# Altium project Inverter_LCEE.PrjPcb (part 1 of 2)
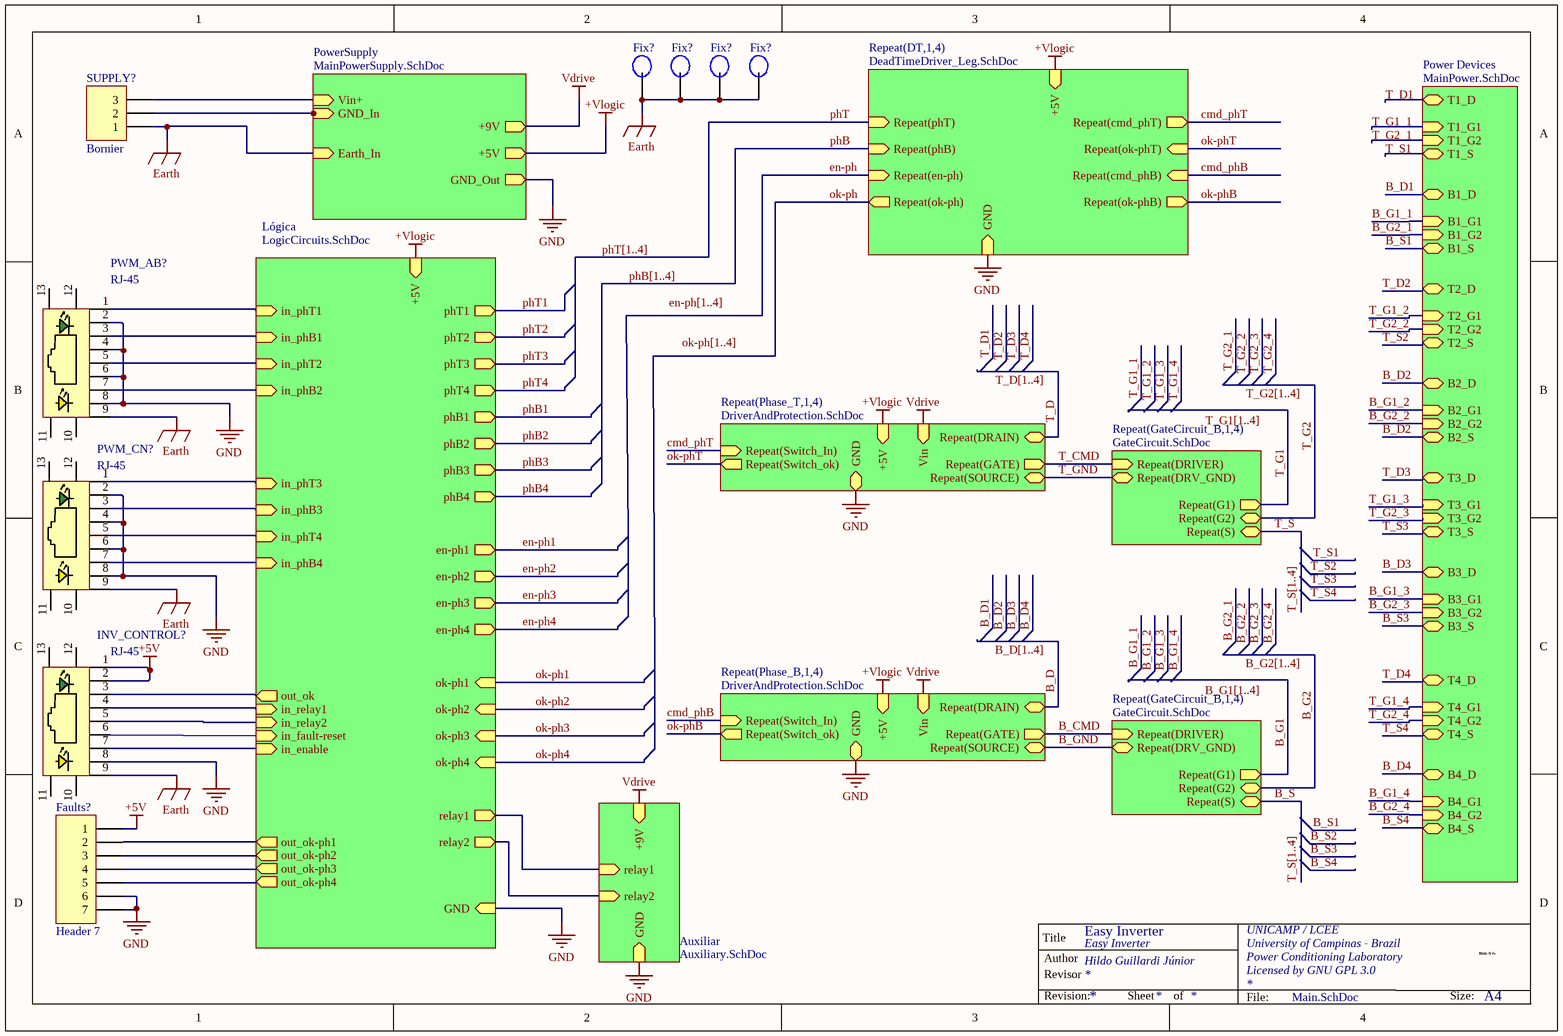
[diagram p0: Main.SchDoc]
9 sheets, 1036 parts. Net scope: hierarchical (ports join the sheet entries above them; power ports are global).
Board file: Inverter_full.PcbDoc
Sheets:
  Main.SchDoc
    Power Devices = MainPower.SchDoc
    Phase_T1 = DriverAndProtection.SchDoc
      Supply_Iso = GateDriverPowerSupply.SchDoc
    Phase_T2 = DriverAndProtection.SchDoc
      Supply_Iso = GateDriverPowerSupply.SchDoc
    Phase_T3 = DriverAndProtection.SchDoc
      Supply_Iso = GateDriverPowerSupply.SchDoc
    Phase_T4 = DriverAndProtection.SchDoc
      Supply_Iso = GateDriverPowerSupply.SchDoc
    Lógica = LogicCircuits.SchDoc
    Auxiliar = Auxiliary.SchDoc
    DT1 = DeadTimeDriver_Leg.SchDoc
    DT2 = DeadTimeDriver_Leg.SchDoc
    DT3 = DeadTimeDriver_Leg.SchDoc
    DT4 = DeadTimeDriver_Leg.SchDoc
    PowerSupply = MainPowerSupply.SchDoc
    GateCircuit_B1 = GateCircuit.SchDoc
    GateCircuit_B2 = GateCircuit.SchDoc
    GateCircuit_B3 = GateCircuit.SchDoc
    GateCircuit_B4 = GateCircuit.SchDoc
    Phase_B1 = DriverAndProtection.SchDoc
      Supply_Iso = GateDriverPowerSupply.SchDoc
    Phase_B2 = DriverAndProtection.SchDoc
      Supply_Iso = GateDriverPowerSupply.SchDoc
    Phase_B3 = DriverAndProtection.SchDoc
      Supply_Iso = GateDriverPowerSupply.SchDoc
    Phase_B4 = DriverAndProtection.SchDoc
      Supply_Iso = GateDriverPowerSupply.SchDoc
    GateCircuit_B1 = GateCircuit.SchDoc
    GateCircuit_B2 = GateCircuit.SchDoc
    GateCircuit_B3 = GateCircuit.SchDoc
    GateCircuit_B4 = GateCircuit.SchDoc

## Sheet Main.SchDoc: Easy Inverter
size A4; Author: Hildo Guillardi Júnior; Organization: UNICAMP / LCEE; Address1: University of Campinas - Brazil; Address2: Power Conditioning Laboratory; Address3: Licensed by GNU GPL 3.0; PageSetup: Record=PageOptions|CenterHorizontal=True|CenterVertical=True|PrintScale=0.98|XCorrection=1.00|YCorrection=1.00|PrintKind=1|BorderSize=5000000|LeftOffset=0|BottomOffset=0|Orientation=2|PaperLength=1000|PaperWidth=1000|Scale=100|PaperSource=257|PrintQuality=600|MediaType=1|DitherType=10|PrintScaleMode=1|PaperKind=A4|PaperIndex=9; ProjectName: Easy Inverter

### Parts
(Parts that share a designator on the sheet are numbered #1, #2 ... from top to bottom, then left to right.)
Faults?  value Header 7  [HDR1X7]
Fix?#1  (no value)  [Pino]
Fix?#2  (no value)  [Pino]
Fix?#3  (no value)  [Pino]
Fix?#4  (no value)  [Pino]
INV_CONTROL?  value RJ-45  [RJ-45]
PWM_AB?  value RJ-45  [RJ-45]
PWM_CN?  value RJ-45  [RJ-45]
SUPPLY?  value Bornier  [3 Pin  Borner]

### Sub-sheets
Auxiliar = Auxiliary.SchDoc: relay1 (in), relay2 (in), GND (in), +9V (in)
Lógica = LogicCircuits.SchDoc: +5V (in), GND (in), out_ok-ph1 (out), out_ok-ph2 (out), ok-ph1 (in), out_ok-ph3 (out), out_ok-ph4 (out), en-ph1 (out), en-ph2 (out), en-ph3 (out), en-ph4 (out), in_enable (in), in_fault-reset (in), in_relay1 (in), relay1 (out), relay2 (out), out_ok (out), ok-ph2 (in), ok-ph3 (in), ok-ph4 (in), phB1 (out), phB2 (out), phT1 (out), phT2 (out), phT3 (out), phB3 (out), phT4 (out), phB4 (out), in_phT1 (in), in_phB1 (in), in_phT2 (in), in_phB2 (in), in_phT4 (in), in_phB4 (in), in_phT3 (in), in_phB3 (in), in_relay2 (in)
Power Devices = MainPower.SchDoc: T1_D (bidir), T1_S (bidir), T1_G1 (in), T1_G2 (in), B1_D (bidir), B1_S (bidir), B1_G1 (in), B1_G2 (in), T2_D (bidir), T2_S (bidir), T2_G1 (in), T2_G2 (in), B2_D (bidir), B2_S (bidir), B2_G1 (in), B2_G2 (in), T3_D (bidir), T3_S (bidir), T3_G1 (in), T3_G2 (in), B3_D (bidir), B3_S (bidir), B3_G1 (in), B3_G2 (in), T4_D (bidir), T4_S (bidir), T4_G1 (in), T4_G2 (in), B4_D (bidir), B4_S (bidir), B4_G1 (in), B4_G2 (in)
PowerSupply = MainPowerSupply.SchDoc: Earth_In (in), +9V (out), +5V (out), GND_Out (out), GND_In (in), Vin+ (in)
Repeat(DT,1,4) = DeadTimeDriver_Leg.SchDoc: Repeat(ok-ph) (out), Repeat(cmd_phT) (out), Repeat(phB) (in), Repeat(ok-phT) (in), Repeat(phT) (in), GND (in), +5V (in), Repeat(ok-phB) (out), Repeat(en-ph) (in), Repeat(cmd_phB) (in)
Repeat(GateCircuit_B,1,4) = GateCircuit.SchDoc: Repeat(G2), Repeat(S), Repeat(G1) (out), Repeat(DRIVER) (in), Repeat(DRV_GND) (bidir)
Repeat(GateCircuit_B,1,4) = GateCircuit.SchDoc: Repeat(G2), Repeat(S), Repeat(G1) (out), Repeat(DRIVER) (in), Repeat(DRV_GND) (bidir)
Repeat(Phase_B,1,4) = DriverAndProtection.SchDoc: Repeat(SOURCE), Repeat(DRAIN), Repeat(GATE) (out), Repeat(Switch_In) (in), Repeat(Switch_ok) (out), +5V (in), Vin (in), GND
Repeat(Phase_T,1,4) = DriverAndProtection.SchDoc: Repeat(SOURCE), Repeat(DRAIN), Repeat(GATE) (out), Repeat(Switch_In) (in), Repeat(Switch_ok) (out), +5V (in), Vin (in), GND

### Nets
+5V: Faults?.1 INV_CONTROL?.1 INV_CONTROL?.2 ; sheet Repeat(Phase_T,1,4)/+5V, sheet Lógica/+5V, sheet Repeat(DT,1,4)/+5V, sheet PowerSupply/+5V, sheet Repeat(Phase_B,1,4)/+5V  [also labelled +Vlogic]
Earth: Fix?#1.0 Fix?#2.0 Fix?#3.0 Fix?#4.0 INV_CONTROL?.9 PWM_AB?.9 PWM_CN?.9 SUPPLY?.1 ; sheet PowerSupply/Earth_In
GND: Faults?.6 Faults?.7 INV_CONTROL?.8 PWM_AB?.2 PWM_AB?.4 PWM_AB?.6 PWM_AB?.8 PWM_CN?.2 PWM_CN?.4 PWM_CN?.6 PWM_CN?.8 SUPPLY?.2 ; sheet Repeat(Phase_T,1,4)/GND, sheet Lógica/GND, sheet Auxiliar/GND, sheet Repeat(DT,1,4)/GND, sheet PowerSupply/GND_Out, sheet PowerSupply/GND_In, sheet Repeat(Phase_B,1,4)/GND  [project net 0]
Vdrive: sheet Repeat(Phase_T,1,4)/Vin, sheet Auxiliar/+9V, sheet PowerSupply/+9V, sheet Repeat(Phase_B,1,4)/Vin  [project net +9V]
B_CMD: sheet Repeat(Phase_B,1,4)/Repeat(GATE), sheet Repeat(GateCircuit_B,1,4)/Repeat(DRIVER)
B_D: sheet Repeat(Phase_B,1,4)/Repeat(DRAIN)
B_D1: sheet Power Devices/T1_S, sheet Power Devices/B1_D  [also labelled T_S1]
B_D2: sheet Power Devices/B1_S, sheet Power Devices/T2_S, sheet Power Devices/B2_D, sheet Power Devices/B2_S  [also labelled B_S1, T_S2]
B_D3: sheet Power Devices/T3_S, sheet Power Devices/B3_D  [also labelled T_S3]
B_G1: sheet Repeat(GateCircuit_B,1,4)/Repeat(G1)
B_G2: sheet Repeat(GateCircuit_B,1,4)/Repeat(G2)
B_GND: sheet Repeat(Phase_B,1,4)/Repeat(SOURCE), sheet Repeat(GateCircuit_B,1,4)/Repeat(DRV_GND)
B_S: sheet Repeat(GateCircuit_B,1,4)/Repeat(S)
cmd_phB: sheet Repeat(DT,1,4)/Repeat(cmd_phB), sheet Repeat(Phase_B,1,4)/Repeat(Switch_In)
cmd_phT: sheet Repeat(Phase_T,1,4)/Repeat(Switch_In), sheet Repeat(DT,1,4)/Repeat(cmd_phT)
en-ph: sheet Repeat(DT,1,4)/Repeat(en-ph)
en-ph1: sheet Lógica/en-ph1, sheet Lógica/en-ph2  [also labelled en-ph2]
en-ph3: sheet Lógica/en-ph3, sheet Lógica/en-ph4  [also labelled en-ph4]
ok-ph: sheet Repeat(DT,1,4)/Repeat(ok-ph)
ok-phB: sheet Repeat(DT,1,4)/Repeat(ok-phB), sheet Repeat(Phase_B,1,4)/Repeat(Switch_ok)
ok-phT: sheet Repeat(Phase_T,1,4)/Repeat(Switch_ok), sheet Repeat(DT,1,4)/Repeat(ok-phT)
phB: sheet Repeat(DT,1,4)/Repeat(phB)
phT: sheet Repeat(DT,1,4)/Repeat(phT)
T_CMD: sheet Repeat(Phase_T,1,4)/Repeat(GATE), sheet Repeat(GateCircuit_B,1,4)/Repeat(DRIVER)
T_D: sheet Repeat(Phase_T,1,4)/Repeat(DRAIN)
T_D1: sheet Power Devices/T1_D, sheet Power Devices/T2_D  [also labelled T_D2]
T_G1: sheet Repeat(GateCircuit_B,1,4)/Repeat(G1)
T_G2: sheet Repeat(GateCircuit_B,1,4)/Repeat(G2)
T_GND: sheet Repeat(Phase_T,1,4)/Repeat(SOURCE), sheet Repeat(GateCircuit_B,1,4)/Repeat(DRV_GND)
T_S: sheet Repeat(GateCircuit_B,1,4)/Repeat(S)
NetCin3_1: SUPPLY?.3 ; sheet PowerSupply/Vin+
NetFaults?_2: Faults?.2 ; sheet Lógica/out_ok-ph1
NetFaults?_3: Faults?.3 ; sheet Lógica/out_ok-ph2
NetFaults?_4: Faults?.4 ; sheet Lógica/out_ok-ph3
NetFaults?_5: Faults?.5 ; sheet Lógica/out_ok-ph4
NetINV_CONTROL?_3: INV_CONTROL?.3 ; sheet Lógica/out_ok
NetINV_CONTROL?_4: INV_CONTROL?.4 ; sheet Lógica/in_relay1
NetINV_CONTROL?_5: INV_CONTROL?.5 ; sheet Lógica/in_relay2
NetINV_CONTROL?_6: INV_CONTROL?.6 ; sheet Lógica/in_fault-reset
NetINV_CONTROL?_7: INV_CONTROL?.7 ; sheet Lógica/in_enable
NetPWM_AB?_1: PWM_AB?.1 ; sheet Lógica/in_phT1
NetPWM_AB?_3: PWM_AB?.3 ; sheet Lógica/in_phB1
NetPWM_AB?_5: PWM_AB?.5 ; sheet Lógica/in_phT2
NetPWM_AB?_7: PWM_AB?.7 ; sheet Lógica/in_phB2
NetPWM_CN?_1: PWM_CN?.1 ; sheet Lógica/in_phT3
NetPWM_CN?_3: PWM_CN?.3 ; sheet Lógica/in_phB3
NetPWM_CN?_5: PWM_CN?.5 ; sheet Lógica/in_phT4
NetPWM_CN?_7: PWM_CN?.7 ; sheet Lógica/in_phB4
NetR2_1: sheet Lógica/relay1, sheet Auxiliar/relay1
NetR4_1: sheet Lógica/relay2, sheet Auxiliar/relay2

Not connected (* = marked no-connect by the designer): INV_CONTROL? 10 11 12 13; PWM_AB? 10 11 12 13; PWM_CN? 10 11 12 13

### Buses and harness runs
bus B_D[1..4]
bus B_G1[1..4]
bus B_G2[1..4]
bus en-ph[1..4]
bus ok-ph[1..4]
bus phB[1..4]
bus phT[1..4]
bus T_D[1..4]
bus T_G1[1..4]
bus T_G2[1..4]
bus T_S[1..4]

### Notes on the sheet
- Labels drawn without touching a wire or pin: B_G1[1..4], en-ph[1..4], ok-ph[1..4], T_G1[1..4], T_S[1..4]
- Title
- Author
- Revisor
- Hildo G Jr
- Revision:
- Sheet
- of
- File:
- Size:
- A4
- HGJr

### Library data of the parts
Faults? = Header 7: Header, 7-Pin
Fix?#1-Fix?#4 = Pino: Value: Pin; pn: 908-100; RM2X12MM 2701
INV_CONTROL? PWM_AB? PWM_CN? = RJ-45: pn: A-2004-2-4-LPS-N-R
SUPPLY? = Header 3: Header, 3-Pin; pn: 1935174

## Sheet MainPower.SchDoc: Main / high power
size A4; Author: Hildo Guillardi Júnior; Organization: UNICAMP / LCEE; Address1: University of Campinas - Brazil; Address2: Power Conditioning Laboratory; Address3: Licensed by GNU GPL 3.0; ProjectName: Easy Inverter
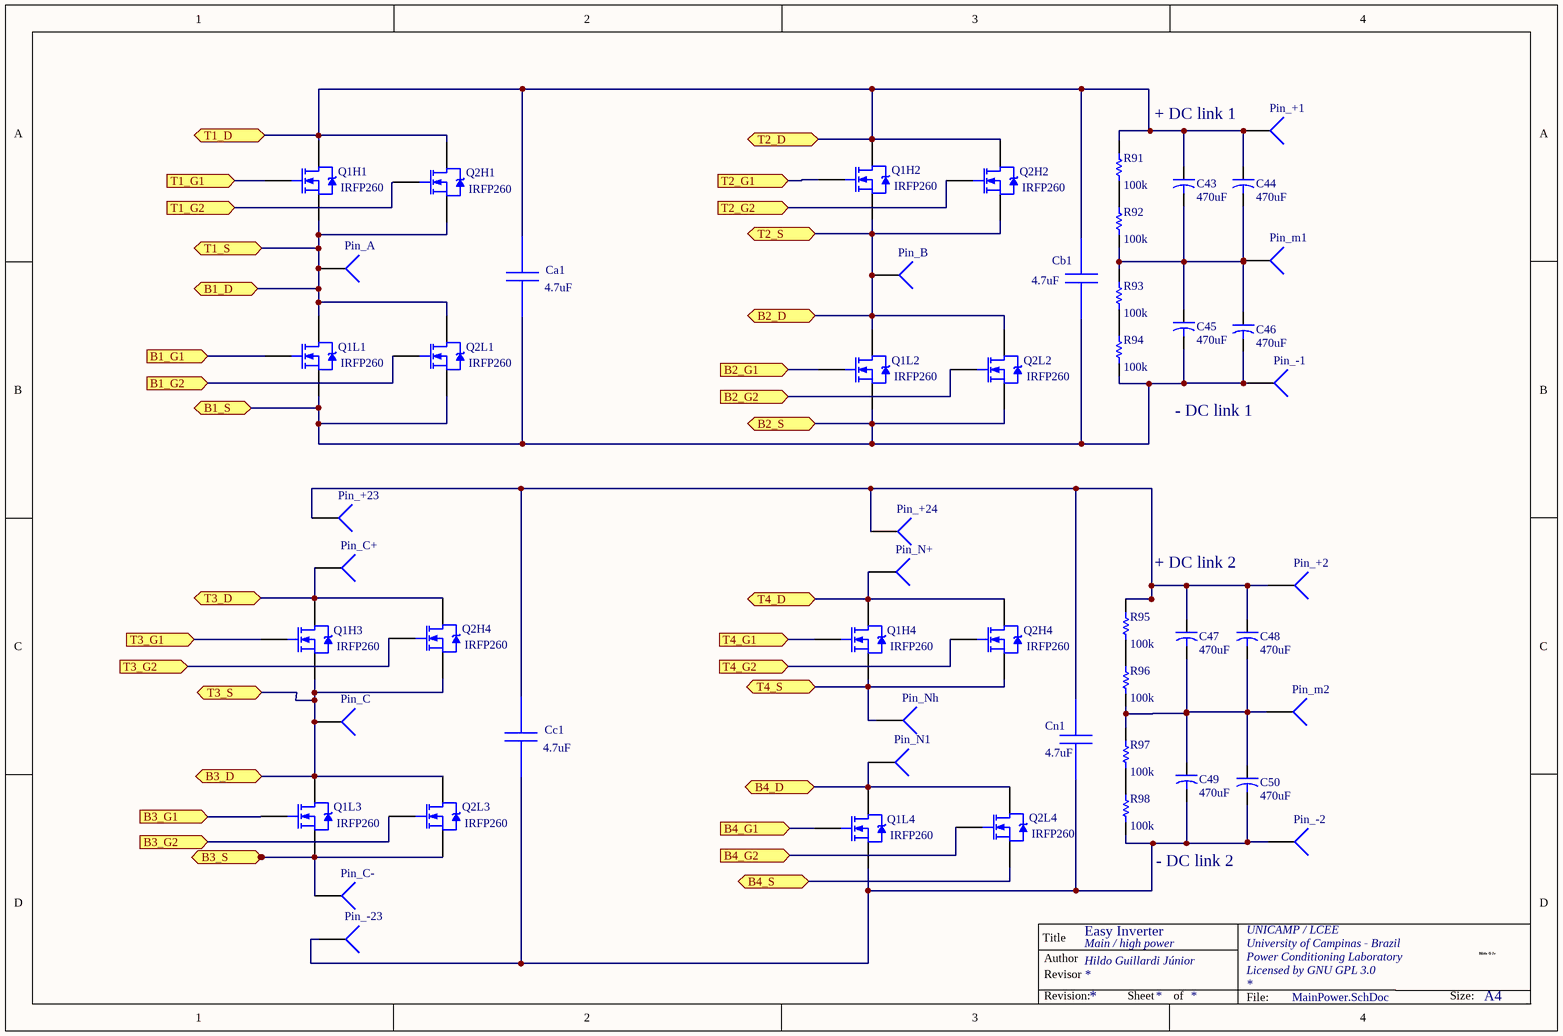
[diagram p1: MainPower.SchDoc]

### Parts
(Parts that share a designator on the sheet are numbered #1, #2 ... from top to bottom, then left to right.)
C43  value 470uF  [Capacitor Eletrolitico - duplicate]
C44  value 470uF  [Capacitor Eletrolitico - duplicate]
C45  value 470uF  [Capacitor Eletrolitico - duplicate]
C46  value 470uF  [Capacitor Eletrolitico - duplicate]
C47  value 470uF  [Capacitor Eletrolitico - duplicate]
C48  value 470uF  [Capacitor Eletrolitico - duplicate]
C49  value 470uF  [Capacitor Eletrolitico - duplicate]
C50  value 470uF  [Capacitor Eletrolitico - duplicate]
Ca1  value 4.7uF  [CApacitor SMD - 22uF]
Cb1  value 4.7uF  [CApacitor SMD - 22uF]
Cc1  value 4.7uF  [CApacitor SMD - 22uF]
Cn1  value 4.7uF  [CApacitor SMD - 22uF]
Pin_+1  (no value)  [Power conector]
Pin_+2  (no value)  [Power conector]
Pin_+23  (no value)  [Power conector]
Pin_+24  (no value)  [Power conector]
Pin_-1  (no value)  [Power conector]
Pin_-2  (no value)  [Power conector]
Pin_-23  (no value)  [Power conector]
Pin_A  (no value)  [Power conector]
Pin_B  (no value)  [Power conector]
Pin_C  (no value)
Pin_C+  (no value)  [Power conector]
Pin_C-  (no value)  [Power conector]
Pin_m1  (no value)  [Power conector]
Pin_m2  (no value)  [Power conector]
Pin_N1  (no value)  [Power conector]
Pin_N+  (no value)  [Power conector]
Pin_Nh  (no value)  [Power conector]
Q1H1  IRFP260  [TO227]
Q1H2  IRFP260  [TO227]
Q1H3  IRFP260  [TO227]
Q1H4  IRFP260  [TO227]
Q1L1  IRFP260  [TO227]
Q1L2  IRFP260  [TO227]
Q1L3  IRFP260  [TO227]
Q1L4  IRFP260  [TO227]
Q2H1  IRFP260  [TO227]
Q2H2  IRFP260  [TO227]
Q2H4#1  IRFP260  [TO227]
Q2H4#2  IRFP260  [TO227]
Q2L1  IRFP260  [TO227]
Q2L2  IRFP260  [TO227]
Q2L3  IRFP260  [TO227]
Q2L4  IRFP260  [TO227]
R91  value 100k  [1210_W]
R92  value 100k  [1210_W]
R93  value 100k  [1210_W]
R94  value 100k  [1210_W]
R95  value 100k  [1210_W]
R96  value 100k  [1210_W]
R97  value 100k  [1210_W]
R98  value 100k  [1210_W]

### Ports
B1_D (bidir), B1_G1 (in), B1_G2 (in), B1_S (bidir), B2_D (bidir), B2_G1 (in), B2_G2 (in), B2_S (bidir), B3_D (bidir), B3_G1 (in), B3_G2 (in), B3_S (bidir), B4_D (bidir), B4_G1 (in), B4_G2 (in), B4_S (bidir), T1_D (bidir), T1_G1 (in), T1_G2 (in), T1_S (bidir), T2_D (bidir), T2_G1 (in), T2_G2 (in), T2_S (bidir), T3_D (bidir), T3_G1 (in), T3_G2 (in), T3_S (bidir), T4_D (bidir), T4_G1 (in), T4_G2 (in), T4_S (bidir)

### Nets
B_D1: Pin_A.1 Q1H1.3(S) Q1L1.2(D) Q2H1.3(S) Q2L1.2(D) ; port B1_D, port T1_S
B_D2: C45.2 C46.2 Ca1.2 Cb1.2 Pin_-1.1 Pin_B.1 Q1H2.3(S) Q1L1.3(S) Q1L2.2(D) Q1L2.3(S) Q2H2.3(S) Q2L1.3(S) Q2L2.2(D) Q2L2.3(S) R94.2 ; port B1_S, port T2_S, port B2_D, port B2_S
B_D3: Pin_C.1 Q1H3.3(S) Q1L3.2(D) Q2H4#1.3(S) Q2L3.2(D) ; port T3_S, port B3_D
B_D4: Pin_N1.1 Q2L4.2(D) ; port B4_D
B_G1_1: Q1L1.1(G) ; port B1_G1
B_G1_2: Q1L2.1(G) ; port B2_G1
B_G1_3: Q1L3.1(G) ; port B3_G1
B_G1_4: Q1L4.1(G) ; port B4_G1
B_G2_1: Q2L1.1(G) ; port B1_G2
B_G2_2: Q2L2.1(G) ; port B2_G2
B_G2_3: Q2L3.1(G) ; port B3_G2
B_G2_4: Q2L4.1(G) ; port B4_G2
B_S3: Pin_C-.1 Q1L3.3(S) Q2L3.3(S) ; port B3_S
B_S4: Q2L4.3(S) ; port B4_S
T_D1: C43.1 C44.1 Ca1.1 Cb1.1 Pin_+1.1 Q1H1.2(D) Q1H2.2(D) Q2H1.2(D) Q2H2.2(D) R91.1 ; port T1_D, port T2_D
T_D3: Pin_C+.1 Q2H4#1.2(D) ; port T3_D
T_D4: Pin_N+.1 Q1H4.2(D) Q2H4#2.2(D) ; port T4_D
T_G1_1: Q1H1.1(G) ; port T1_G1
T_G1_2: Q1H2.1(G) ; port T2_G1
T_G1_3: Q1H3.1(G) ; port T3_G1
T_G1_4: Q1H4.1(G) ; port T4_G1
T_G2_1: Q2H1.1(G) ; port T1_G2
T_G2_2: Q2H2.1(G) ; port T2_G2
T_G2_3: Q2H4#1.1(G) ; port T3_G2
T_G2_4: Q2H4#2.1(G) ; port T4_G2
T_S4: Pin_Nh.1 Q1H4.3(S) Q2H4#2.3(S) ; port T4_S
NetC43_2: C43.2 C44.2 C45.1 C46.1 Pin_m1.1 R92.2 R93.1
NetC47_1: C47.1 C48.1 Cc1.1 Cn1.1 Pin_+2.1 Pin_+23.1 Pin_+24.1 R95.1
NetC47_2: C47.2 C48.2 C49.1 C50.1 Pin_m2.1 R96.2 R97.1
NetC49_2: C49.2 C50.2 Cc1.2 Cn1.2 Pin_-2.1 Pin_-23.1 Q1L4.3(S) R98.2
NetR91_2: R91.2 R92.1
NetR93_2: R93.2 R94.1
NetR95_2: R95.2 R96.1
NetR97_2: R97.2 R98.1

Not connected (* = marked no-connect by the designer): Q1H3 2(D); Q1L4 2(D)

### Notes on the sheet
- (near Pin_+1) + DC link 1
- (near Pin_-1) - DC link 1
- + DC link 2
- - DC link 2
- Title
- Author
- Revisor
- Hildo G Jr
- Revision:
- Sheet
- of
- File:
- Size:
- A4
- HGJr

### Library data of the parts
C43-C50 = Cap2: Capacitor; PackageReference: CAPR5-4X5; Published: 23-Sep-2002; Publisher: Altium Limited; PackageDescription: Capacitor; 2 Leads
Ca1 Cb1 Cc1 Cn1 = GRM21BC81E475KA12L: Manufacturer Name: MuRata; PackageReference: GRM21BC81E475KA12L; Manufacturer Part Number: GRM21BC81E475KA12L
Pin_+1 Pin_+2 Pin_+23 Pin_+24 Pin_-1 Pin_-2 Pin_-23 Pin_A Pin_B Pin_C Pin_C+ Pin_C- Pin_m1 Pin_m2 Pin_N1 Pin_N+ Pin_Nh = Socket: pn: 7799; Value: screw
Q1H1-Q1H4 Q1L1-Q1L4 Q2H1 Q2H2 Q2H4#1 Q2H4#2 Q2L1-Q2L4 = IRFP260: HEXFET Power MOSFET; pn: 4180G; RM3X10MM 2701; IRFP260MPBF; 28N65M2; C3M0280090D; Value: IRFP260
R91-R98 = Res_0805: Resistor; Manufacturer: Generic Components; Class: Passive; Published: 08/06/2000; Publisher: Altium Hobart Technology Centre; SubClass: Resistor

## Sheet DriverAndProtection.SchDoc: Drive and protections
size A4; CheckedBy: Hildo Guillardi Júnior; Author: Fellipe; Organization: UNICAMP / LCEE; Address1: University of Campinas - Brazil; Address2: Power Conditioning Laboratory; Address3: Licensed by GNU GPL 3.0; ProjectName: Easy Inverter
Used 8 times, as channels Phase_T1, Phase_T2, Phase_T3, Phase_T4, Phase_B1, Phase_B2, Phase_B3, Phase_B4. Parts and nets are listed once, with the designators drawn on the sheet.
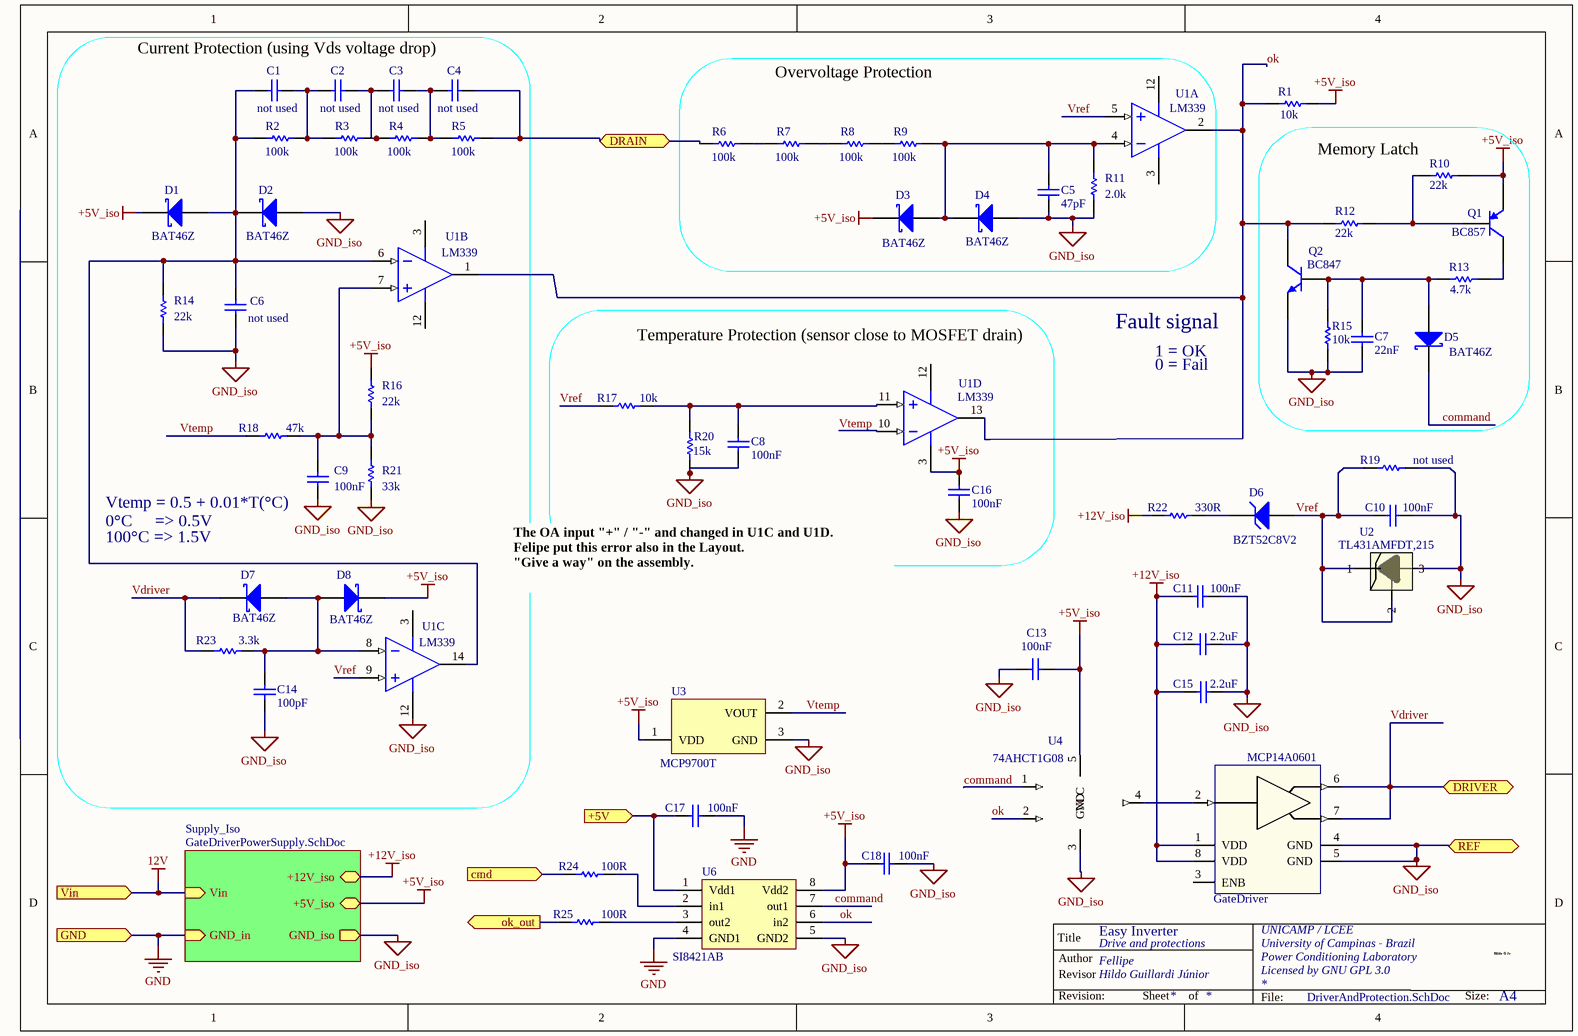
[diagram p2: DriverAndProtection.SchDoc]

### Parts
C1  value not used  [0805_W]
C2  value not used  [0805_W]
C3  value not used  [0805_W]
C4  value not used  [0805_W]
C5  value 47pF  [0805_W]
C6  value not used  [0805_W]
C7  value 22nF  [0805_W]
C8  value 100nF  [0805_W]
C9  value 100nF  [0805_W]
C10  value 100nF  [0805_W]
C11  value 100nF  [0805_W]
C12  value 2.2uF  [0805_W]
C13  value 100nF  [0805_W]
C14  value 100pF  [0805_W]
C15  value 2.2uF  [0805_W]
C16  value 100nF  [0805_W]
C17  value 100nF  [0805_W]
C18  value 100nF  [0805_W]
D1  value BAT46Z  [SOD-123]
D2  value BAT46Z  [SOD-123]
D3  value BAT46Z  [SOD-123]
D4  value BAT46Z  [SOD-123]
D5  value BAT46Z  [SOD-123]
D6  value BZT52C8V2  [SOD-123]
D7  value BAT46Z  [SOD-123]
D8  value BAT46Z  [SOD-123]
GateDriver  value MCP14A0601  [SOIC-8N]
Q1  value BC857  [SOT-23-TT3_N]
Q2  value BC847  [SOT-23-TT3_N]
R1  value 10k  [0805_W]
R2  value 100k  [0805_W]
R3  value 100k  [0805_W]
R4  value 100k  [0805_W]
R5  value 100k  [0805_W]
R6  value 100k  [0805_W]
R7  value 100k  [0805_W]
R8  value 100k  [0805_W]
R9  value 100k  [0805_W]
R10  value 22k  [0805_W]
R11  value 2.0k  [0805_W]
R12  value 22k  [0805_W]
R13  value 4.7k  [0805_W]
R14  value 22k  [0805_W]
R15  value 10k  [0805_W]
R16  value 22k  [0805_W]
R17  value 10k  [0805_W]
R18  value 47k  [0805_W]
R19  value not used  [0805_W]
R20  value 15k  [0805_W]
R21  value 33k  [0805_W]
R22  value 330R  [0805_W]
R23  value 3.3k  [0805_W]
R24  value 100R  [0805_W]
R25  value 100R  [0805_W]
U1  value LM339  [SOIC-14N]  (parts A,B,C,D of 4)
U2  value TL431AMFDT,215  [SOT-23-TT3_M]
U3  value MCP9700T  [SOT-23_L]
U4  value 74AHCT1G08  [SOT353]
U6  value SI8421AB  [SOIC-8N]

### Blocks framed on the sheet
Overvoltage Protection: C5 D3 D4 R6-R9 R11 U1
Memory Latch: C7 D5 Q1 Q2 R10 R12 R13 R15
Temperature Protection (sensor close to MOSFET drain): C8 C16 R17 R20 U1

### Sub-sheets
Supply_Iso = GateDriverPowerSupply.SchDoc: +12V_iso (bidir), +5V_iso (bidir), GND_iso (out), GND_in (in), Vin (in)

### Ports
+5V (in), cmd (in), DRAIN, DRIVER, GND (in), ok_out (out), REF, Vin (in)

### Nets
12V: port Vin, sheet Supply_Iso/Vin
+5V_iso: C13.1 C16.1 C18.2 D1.2(K) D3.2(K) D8.2(K) Q1.2(E) R1.2 R10.1 R16.2 U1.3(V+) U3.1(VDD) U4.5(VCC) U6.8(Vdd2) ; sheet Supply_Iso/+5V_iso
+12V_iso: C11.2 C12.1 C15.1 GateDriver.1(VDD) GateDriver.8(VDD) R22.1 ; sheet Supply_Iso/+12V_iso
GND: C17.1 U6.4(GND1) ; port GND, sheet Supply_Iso/GND_in
GND_iso: C5.2 C6.2 C7.2 C8.2 C9.2 C10.2 C11.1 C12.2 C13.2 C14.2 C15.2 C16.2 C18.1 D2.1(A) D4.1(A) GateDriver.4(GND) GateDriver.5(GND) Q2.2(E) R11.1 R14.1 R15.2 R19.2 R20.2 R21.2 U1.12(V-) U2.3 U3.3(GND) U4.3(GND) U6.5(GND2) ; port REF, sheet Supply_Iso/GND_iso
+5V: C17.2 U6.1(Vdd1) ; port +5V
cmd: R24.2 ; port cmd
command: D5.2(K) U4.1(OE*) U6.7(out1)
DRAIN: C4.1 R5.2 R6.2 ; port DRAIN
ok: Q2.3(C) R1.1 R12.2 U1.1(OUT) U1.2(OUT) U1.13(OUT) U4.2(IN) U6.6(in2)
ok_out: R25.2 ; port ok_out
Vdriver: D7.2(K) GateDriver.6 GateDriver.7 R23.2 ; port DRIVER
Vref: C10.1 D6.1(A) R17.2 R19.1 U1.5(IN+) U1.9(IN+) U2.1 U2.2
Vtemp: R18.2 U3.2(VOUT)
NetC1_1: C1.1 C2.2 R2.2 R3.2
NetC1_2: C1.2 C6.1 D1.1(A) D2.2(K) R2.1 R14.2 U1.6(IN-) U1.14(OUT)
NetC2_1: C2.1 C3.2 R3.1 R4.2
NetC3_1: C3.1 C4.2 R4.1 R5.1
NetC5_1: C5.1 D3.1(A) D4.2(K) R9.1 R11.2 U1.4(IN-)
NetC7_1: C7.1 D5.1(A) Q2.1(B) R13.2 R15.1
NetC8_1: C8.1 R17.1 R20.1 U1.11(IN+)
NetC9_1: C9.1 R16.1 R18.1 R21.1 U1.7(IN+)
NetC14_1: C14.1 D7.1(A) D8.1(A) R23.1 U1.8(IN-)
NetD6_2: D6.2(K) R22.2
NetGateDriver_2: GateDriver.2 U4.4(OUT)
NetQ1_1: Q1.1(B) R10.2 R12.1
NetQ1_3: Q1.3(C) R13.1
NetR6_1: R6.1 R7.2
NetR7_1: R7.1 R8.2
NetR8_1: R8.1 R9.2
NetR24_1: R24.1 U6.2(in1)
NetR25_1: R25.1 U6.3(out2)

Not connected (* = marked no-connect by the designer): GateDriver 3(ENB); U1 10(IN-)

### Channels
Phase_T1: designators C1=C8.2 C2=C9.2 C3=C10.2 C4=C11.2 C5=C13.2 C6=C14.2 C7=C15.2 C8=C8_Phase_T1 C9=C17.2 C10=C18.2 C11=C19.2 C12=C20.2 C13=C13_Phase_T1 C14=C22.2 C15=C21.2 C16=C24.2 C17=C25.2 C18=C26.2 D1=D9.2 D2=D10.2 D3=D11.2 D4=D12.2 D5=D13.2 D6=D6_Phase_T1 D7=D15.2 D8=D16.2 GateDriver=GateDriver_Phase_T1 Q1=Q3.2 Q2=Q4.2 R1=R18.2 R2=R19.2 R3=R20.2 R4=R21.2 R5=R22.2 R6=R23.2 R7=R24.2 R8=R25.2 R9=R26.2 R10=R10_Phase_T1 R11=R27.2 R12=R28.2 R13=R29.2 R14=R14_Phase_T1 R15=R15_Phase_T1 R16=R31.2 R17=R32.2 R18=R33.2 R19=R19_Phase_T1 R20=R34.2 R21=R35.2 R22=R22_Phase_T1 R23=R37.2 R24=R40.2 R25=R41.2 U1=U5.2 U2=U2_Phase_T1 U3=U7.2 U4=U4_Phase_T1 U6=U6_Phase_T1; ports +5V=+5V cmd=NetR40.2_2 DRAIN=T_D1 DRIVER=Vdriver_Phase_T1 GND=0 ok_out=NetR41.2_2 REF=GND_iso Vin=+9V
Phase_T2: designators C1=C8.1 C2=C9.1 C3=C10.1 C4=C11.1 C5=C13.1 C6=C14.1 C7=C15.1 C8=C8_Phase_T2 C9=C17.1 C10=C18.1 C11=C19.1 C12=C20.1 C13=C13_Phase_T2 C14=C22.1 C15=C21.1 C16=C24.1 C17=C25.1 C18=C26.1 D1=D9.1 D2=D10.1 D3=D11.1 D4=D12.1 D5=D13.1 D6=D6_Phase_T2 D7=D15.1 D8=D16.1 GateDriver=GateDriver_Phase_T2 Q1=Q3.1 Q2=Q4.1 R1=R18.1 R2=R19.1 R3=R20.1 R4=R21.1 R5=R22.1 R6=R23.1 R7=R24.1 R8=R25.1 R9=R26.1 R10=R10_Phase_T2 R11=R27.1 R12=R28.1 R13=R29.1 R14=R14_Phase_T2 R15=R15_Phase_T2 R16=R31.1 R17=R32.1 R18=R33.1 R19=R19_Phase_T2 R20=R34.1 R21=R35.1 R22=R22_Phase_T2 R23=R37.1 R24=R40.1 R25=R41.1 U1=U5.1 U2=U2_Phase_T2 U3=U7.1 U4=U4_Phase_T2 U6=U6_Phase_T2; ports +5V=+5V cmd=NetR40.1_2 DRAIN=T_D1 DRIVER=Vdriver_Phase_T2 GND=0 ok_out=NetR41.1_2 REF=GND_iso Vin=+9V
Phase_T3: designators end in _Phase_T3; ports +5V=+5V cmd=NetR24_Phase_T3_2 DRAIN=T_D3 DRIVER=Vdriver_Phase_T3 GND=0 ok_out=NetR25_Phase_T3_2 REF=GND_iso Vin=+9V
Phase_T4: designators end in _Phase_T4; ports +5V=+5V cmd=NetR24_Phase_T4_2 DRAIN=T_D4 DRIVER=Vdriver_Phase_T4 GND=0 ok_out=NetR25_Phase_T4_2 REF=GND_iso Vin=+9V
Phase_B1: designators end in _Phase_B1; ports +5V=+5V cmd=NetR24_Phase_B1_2 DRAIN=B_D1 DRIVER=Vdriver_Phase_B1 GND=0 ok_out=NetR25_Phase_B1_2 REF=GND_iso Vin=+9V
Phase_B2: designators end in _Phase_B2; ports +5V=+5V cmd=NetR24_Phase_B2_2 DRAIN=B_D2 DRIVER=Vdriver_Phase_B2 GND=0 ok_out=NetR25_Phase_B2_2 REF=GND_iso Vin=+9V
Phase_B3: designators end in _Phase_B3; ports +5V=+5V cmd=NetR24_Phase_B3_2 DRAIN=B_D3 DRIVER=Vdriver_Phase_B3 GND=0 ok_out=NetR25_Phase_B3_2 REF=GND_iso Vin=+9V
Phase_B4: designators end in _Phase_B4; ports +5V=+5V cmd=NetR24_Phase_B4_2 DRAIN=B_D4 DRIVER=Vdriver_Phase_B4 GND=0 ok_out=NetR25_Phase_B4_2 REF=GND_iso Vin=+9V

### Notes on the sheet
- Current Protection (using Vds voltage drop)
- (near Q2) Fault signal
- 1 = OK
- 0 = Fail
- (near C9) Vtemp = 0.5 + 0.01*T(°C)
- 0°C     => 0.5V
- 100°C => 1.5V
- The OA input "+" / "-" and changed in U1C and U1D.
  Felipe put this error also in the Layout.
  "Give a way" on the assembly.
- Labels drawn without touching a wire or pin: Vtemp
- Title
- Author
- Revisor
- Hildo G Jr
- Revision:
- Sheet
- of
- File:
- Size:
- A4
- HGJr

### Library data of the parts
C1-C4 C6 = Cap_0805: Capacitor
  C1-C4: Published: 8-Jun-2000; LatestRevisionDate: 17-Jul-2002; LatestRevisionNote: Re-released for DXP Platform.; PackageReference: RAD-0.3; Publisher: Altium Limited
C5 = Cap_0805: Capacitor; pn: C0805C473K8RAC7800
C7 = Cap_0805: Capacitor; pn: C0805C223K8RACTU
C8-C11 C17 C18 = Cap_0805: Capacitor; pn: 08053C104KAT2A
C12 C15 = Capacitor_nao_polarizado: Capacitor nao polarizado; pn: 08053C225KAT2A
C13 C16 = Cap_0805: Capacitor; pn: C0805C104K8RACTU
C14 = Cap_0805: Capacitor; pn: 08053C101KAT2A
D1-D4 D7 D8 = D Schottky: Schottky Diode; pn: BAT46ZFILM
D5 = Schottky: Diodo Schottky; pn: BAT46ZFILM
D6 = D Zener: Zener Diode; pn: BZT52C8V2-FDICT-ND
GateDriver = GateDriver: pn: MIC4420YM-TR;MIC4422ZM
Q1 = BC857: PNP General-purpose Transistor; pn: BC857BLT1G
Q2 = BC847: NPN General-purpose Transistor; pn: BC847BLT1G
R1 R17 = Res_0805: Resistor; pn: RMCF0805JT10K0
R2-R9 = Res_0805: Resistor; pn: RMCF0805JT100K
R10 = Res_0805: Resistor- Not Used; pn: RMCF0805JT22K0
R11 = Res_0805: Resistor; pn: RMCF0805JT2K00
R12 R16 = Res_0805: Resistor; pn: RMCF0805JT22K0
R13 = Res_0805: Resistor; pn: RMCF0805JT4K70
R14 = Res_0805: Resistor; pn: RMCF0805JT560K
R15 = Res_0805: Resistor- Not Used; pn: RMCF0805JT10K0
R18 = Res_0805: Resistor; pn: RMCF0805JT5K60
R19 = Res_0805: Resistor- Not Used
R20 = Res_0805: Resistor; pn: RMCF0805JT15K0
R21 = Res_0805: Resistor; pn: RMCF0805JT33K0
R22 = Res_0805: Resistor- Not Used; pn: RMCF0805JT330R
R23 = Res_0805: Resistor; pn: RMCF0805JT3k30
R24 R25 = Res_0805: Resistor; pn: RMCF0805JT100R
U1 = LM339AD: Low-Power Quad Voltage Comparator; pn: LM339DT
U2 = TL431ACLP: pn: TL431AMFDT\,215
U3 = MCP9700T-E/TT: Low-Power Linear Active Thermistor IC, 3-Pin SOT-23, Extended Temperature, Tape and Reel; pn: MCP9700T-E/TT
U4 = AND: pn: 74AHCT1G08SE-7
U6 = Si8421: Two Channel, High Speed Digital Isolators; pn: SI8421AB-D-IS;SI8422BB-D-IS;FOD8012A

## Sheet GateDriverPowerSupply.SchDoc: Isolated power supply
size A4; Date: Power Conditioning Laboratory; CheckedBy: Hildo / Joel; Author: Fellipe / Arthur; Organization: UNICAMP / LCEE; Address1: University of Campinas - Brazil; Address2: Power Conditioning Laboratory; Address3: Licensed by GNU GPL 3.0; CurrentTime: University of Campinas - Brazil; DocumentFullPathAndName: Licensed by GNU GPL 3.0; ProjectName: Easy Inverter
Used 8 times, as channels Phase_T1/Supply_Iso, Phase_T2/Supply_Iso, Phase_T3/Supply_Iso, Phase_T4/Supply_Iso, Phase_B1/Supply_Iso, Phase_B2/Supply_Iso, Phase_B3/Supply_Iso, Phase_B4/Supply_Iso. Parts and nets are listed once, with the designators drawn on the sheet.
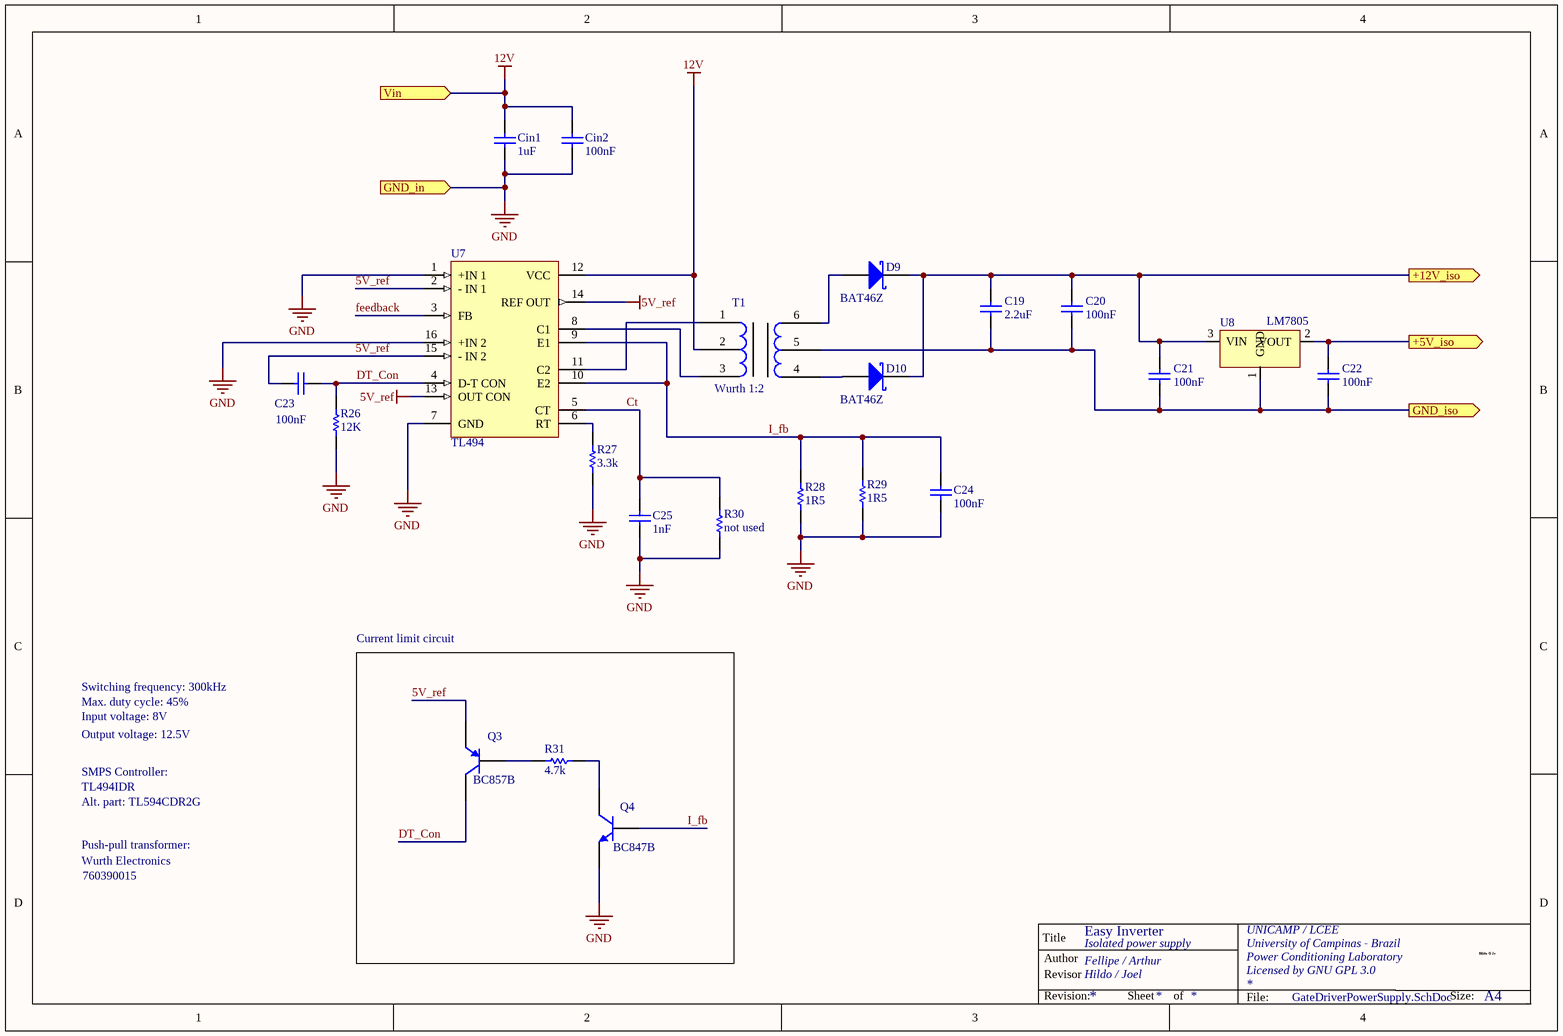
[diagram p3: GateDriverPowerSupply.SchDoc]

### Parts
C19  value 2.2uF  [0805_W]
C20  value 100nF  [0805_W]
C21  value 100nF  [0805_W]
C22  value 100nF  [0805_W]
C23  value 100nF  [0805_W]
C24  value 100nF  [0805_W]
C25  value 1nF  [0805_W]
Cin1  value 1uF  [0805_W]
Cin2  value 100nF  [0805_W]
D9  value BAT46Z  [SOD-123]
D10  value BAT46Z  [SOD-123]
Q3  value BC857B  [SOT-23-TT3_N]
Q4  value BC847B  [SOT-23-TT3_N]
R26  value 12K  [0805_W]
R27  value 3.3k  [0805_W]
R28  value 1R5  [0805_W]
R29  value 1R5  [0805_W]
R30  value not used  [0805_W]
R31  value 4.7k  [0805_W]
T1  value Wurth 1:2  [Trafo]
U7  value TL494  [SOIC16_M]
U8  value LM7805  [LM78XX]

### Blocks framed on the sheet
Current limit circuit: Q3 Q4 R31

### Ports
+5V_iso (out), +12V_iso (out), GND_in (in), GND_iso (out), Vin (in)

### Nets
5V_ref: C23.1 Q3.2(E) U7.2(-_IN_1) U7.13(OUT_CON) U7.14(REF_OUT) U7.15(-_IN_2)
12V: Cin1.1 Cin2.1 T1.2 U7.12(VCC) ; port Vin
GND: C24.1 C25.2 Cin1.2 Cin2.2 Q4.2(E) R26.1 R27.1 R28.1 R29.1 R30.1 U7.1(+IN_1) U7.7(GND) U7.16(+IN_2) ; port GND_in
+5V_iso: C22.1 U8.2(VOUT) ; port +5V_iso
+12V_iso: C19.1 C20.1 C21.1 D9.2(K) D10.2(K) U8.3(VIN) ; port +12V_iso
Ct: C25.1 R30.2 U7.5(CT)
DT_Con: C23.2 Q3.3(C) R26.2 U7.4(D-T_CON)
feedback: U7.3(FB)
GND_iso: C19.2 C20.2 C21.2 C22.2 T1.5 U8.1(GND) ; port GND_iso
I_fb: C24.2 Q4.1(B) R28.2 R29.2 U7.9(E1) U7.10(E2)
NetD9_1: D9.1(A) T1.6
NetD10_1: D10.1(A) T1.4
NetQ3_1: Q3.1(B) R31.2
NetQ4_3: Q4.3(C) R31.1
NetR27_2: R27.2 U7.6(RT)
NetT1_1: T1.1 U7.11(C2)
NetT1_3: T1.3 U7.8(C1)

### Channels
Phase_T1/Supply_Iso: designators C19=C27.1 C20=C29.1 C21=C30.1 C22=C32.1 C23=C31.1 C24=C33.1 C25=C34.1 Cin1=Cin1.1 Cin2=Cin2.1 D9=D9_Phase_T1_Supply_Iso D10=D10_Phase_T1_Supply_Iso Q3=Q5.1 Q4=Q6.1 R26=R42.1 R27=R43.1 R28=R44.1 R29=R45.1 R30=R46.1 R31=R47.1 T1=Transformer1.1 U7=U9.1 U8=Reg1.1; ports +5V_iso=+5V_iso +12V_iso=+12V_iso GND_in=0 GND_iso=GND_iso Vin=+9V
Phase_T2/Supply_Iso: designators C19=C27.2 C20=C29.2 C21=C30.2 C22=C32.2 C23=C31.2 C24=C33.2 C25=C34.2 Cin1=Cin1.2 Cin2=Cin2.2 D9=D9_Phase_T2_Supply_Iso D10=D10_Phase_T2_Supply_Iso Q3=Q5.2 Q4=Q6.2 R26=R42.2 R27=R43.2 R28=R44.2 R29=R45.2 R30=R46.2 R31=R47.2 T1=Transformer1.2 U7=U9.2 U8=Reg1.2; ports +5V_iso=+5V_iso +12V_iso=+12V_iso GND_in=0 GND_iso=GND_iso Vin=+9V
Phase_T3/Supply_Iso: designators end in _Phase_T3_Supply_Iso; ports +5V_iso=+5V_iso +12V_iso=+12V_iso GND_in=0 GND_iso=GND_iso Vin=+9V
Phase_T4/Supply_Iso: designators end in _Phase_T4_Supply_Iso; ports +5V_iso=+5V_iso +12V_iso=+12V_iso GND_in=0 GND_iso=GND_iso Vin=+9V
Phase_B1/Supply_Iso: designators end in _Phase_B1_Supply_Iso; ports +5V_iso=+5V_iso +12V_iso=+12V_iso GND_in=0 GND_iso=GND_iso Vin=+9V
Phase_B2/Supply_Iso: designators end in _Phase_B2_Supply_Iso; ports +5V_iso=+5V_iso +12V_iso=+12V_iso GND_in=0 GND_iso=GND_iso Vin=+9V
Phase_B3/Supply_Iso: designators end in _Phase_B3_Supply_Iso; ports +5V_iso=+5V_iso +12V_iso=+12V_iso GND_in=0 GND_iso=GND_iso Vin=+9V
Phase_B4/Supply_Iso: designators end in _Phase_B4_Supply_Iso; ports +5V_iso=+5V_iso +12V_iso=+12V_iso GND_in=0 GND_iso=GND_iso Vin=+9V

### Notes on the sheet
- Switching frequency: 300kHz
- Max. duty cycle: 45%
- Input voltage: 8V
- SMPS Controller:
- TL494IDR
- Output voltage: 12.5V
- Alt. part: TL594CDR2G
- Push-pull transformer:
- Wurth Electronics
- 760390015
- Title
- Author
- Revisor
- Hildo G Jr
- Revision:
- Sheet
- of
- File:
- Size:
- A4
- HGJr

### Library data of the parts
C19 = Capacitor_nao_polarizado: as C12 on sheet DriverAndProtection
C20-C22 = Capacitor_nao_polarizado: Capacitor nao polarizado; pn: 08053C104KAT2A
C23 C24 Cin2 = Cap_0805: Capacitor; pn: 08053C104KAT2A
C25 = Cap_0805: Capacitor; pn: 08053C102KAT2A
Cin1 = Cap_0805: Capacitor; pn: 08053C105KAT2A
D9 D10 = D Schottky: Schottky Diode; pn: BAT46ZFILM
Q3 = BC857: as Q1 on sheet DriverAndProtection
Q4 = BC847: as Q2 on sheet DriverAndProtection
R26 = Res_0805: Resistor; pn: RMCF0805JT12K0
R27 = Res_0805: Resistor; pn: RMCF0805JT3K30
R28 R29 = Res_0805: Resistor; pn: RMCF0805JT1R50
R30 = Res_0805: as R91 on sheet MainPower; Published: 08/06/2000; Publisher: Altium Hobart Technology Centre; SubClass: Resistor
R31 = Res_0805: Resistor; pn: RMCF0805JT4K70
T1 = Trafo-TI: pn: 760390015
U7 = TL494ID: Pulse-Width-Modulation Control Circuit; pn: TL494IDR
U8 = LM7805: pn: UA78M05CDCY

## Sheet LogicCircuits.SchDoc: Logic circuits
size A4; CheckedBy: Joel Guerreiro; Author: Hildo Guillardi Júnior; Organization: UNICAMP / LCEE; Address1: University of Campinas - Brazil; Address2: Power Conditioning Laboratory; Address3: Licensed by GNU GPL 3.0; Revision: Joel Guerreiro; ProjectName: Easy Inverter
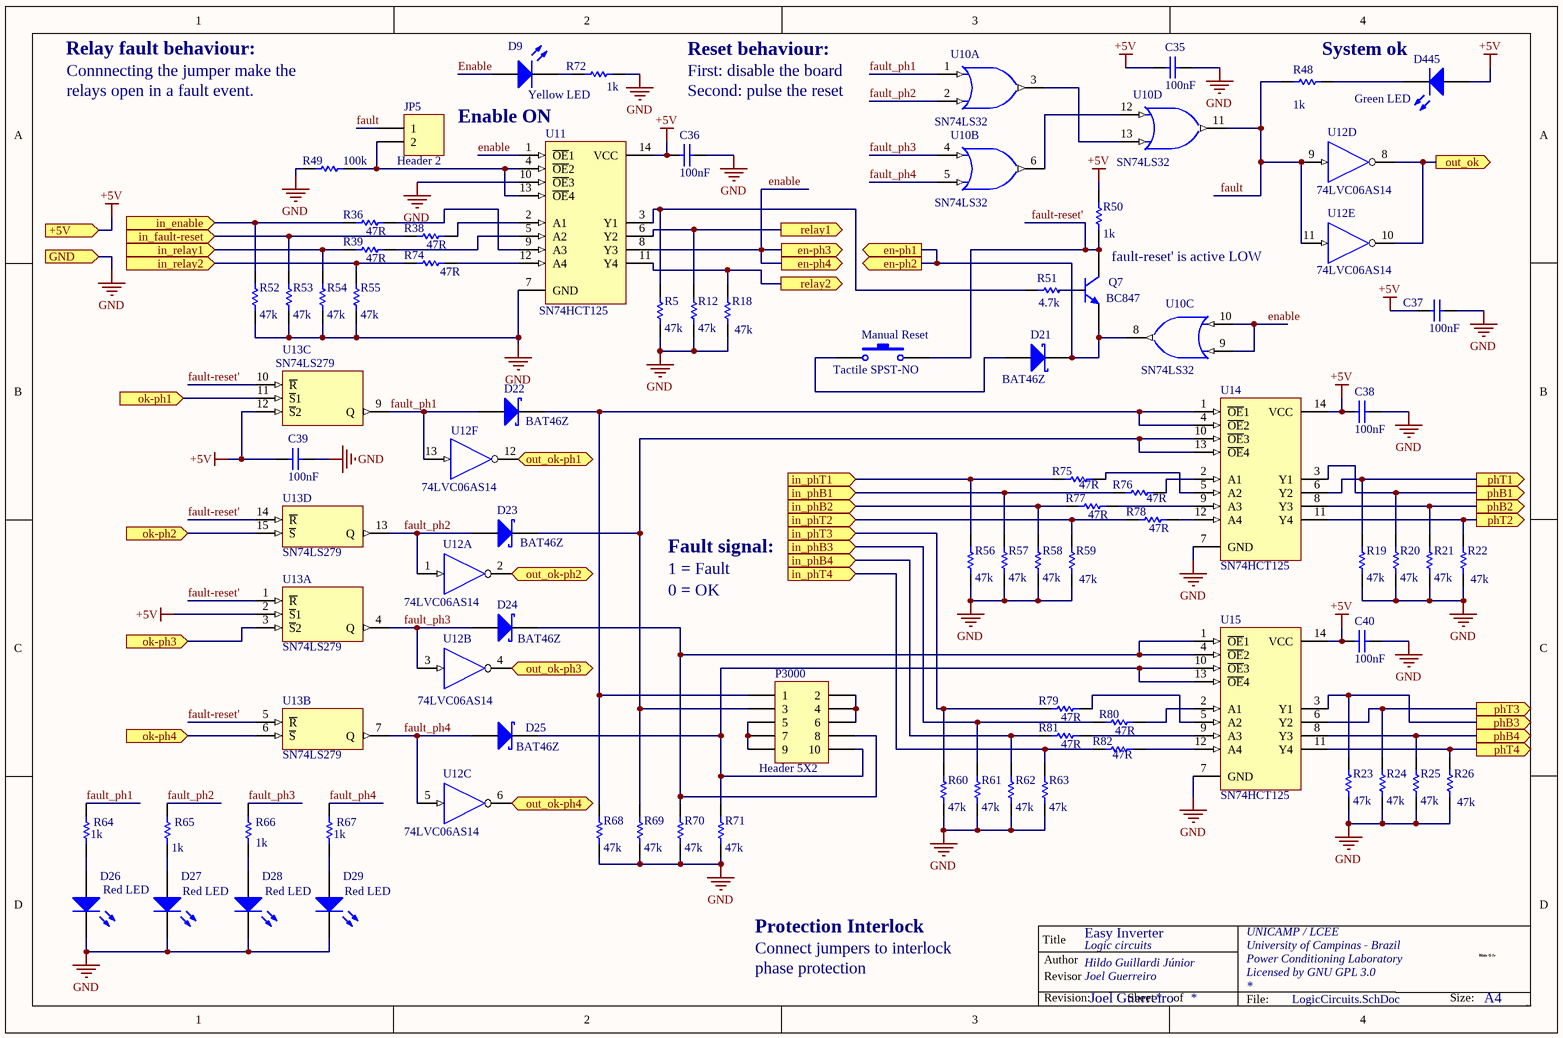
[diagram p4: LogicCircuits.SchDoc]

### Parts
C35  value 100nF  [0805_W]
C36  value 100nF  [0805_W]
C37  value 100nF  [0805_W]
C38  value 100nF  [0805_W]
C39  value 100nF  [0805_W]
C40  value 100nF  [0805_W]
D9  value Yellow LED  [LED_0805]
D21  value BAT46Z  [SOD-123]
D22  value BAT46Z  [SOD-123]
D23  value BAT46Z  [SOD-123]
D24  value BAT46Z  [SOD-123]
D25  value BAT46Z  [SOD-123]
D26  value Red LED  [LED_0805]
D27  value Red LED  [LED_0805]
D28  value Red LED  [LED_0805]
D29  value Red LED  [LED_0805]
D445  value Green LED  [LED_0805]
JP5  value Header 2  [HDR1X2]
Manual_Reset  value Tactile SPST-NO  [Tactile SPST-NO]
P3000  value Header 5X2  [HDR2X5]
Q7  value BC847  [SOT-23-TT3_N]
R5  value 47k  [0805_W]
R12  value 47k  [0805_W]
R18  value 47k  [0805_W]
R19  value 47k  [0805_W]
R20  value 47k  [0805_W]
R21  value 47k  [0805_W]
R22  value 47k  [0805_W]
R23  value 47k  [0805_W]
R24  value 47k  [0805_W]
R25  value 47k  [0805_W]
R26  value 47k  [0805_W]
R36  value 47R  [0805_W]
R38  value 47R  [0805_W]
R39  value 47R  [0805_W]
R48  value 1k  [0805_W]
R49  value 100k  [0805_W]
R50  value 1k  [0805_W]
R51  value 4.7k  [0805_W]
R52  value 47k  [0805_W]
R53  value 47k  [0805_W]
R54  value 47k  [0805_W]
R55  value 47k  [0805_W]
R56  value 47k  [0805_W]
R57  value 47k  [0805_W]
R58  value 47k  [0805_W]
R59  value 47k  [0805_W]
R60  value 47k  [0805_W]
R61  value 47k  [0805_W]
R62  value 47k  [0805_W]
R63  value 47k  [0805_W]
R64  value 1k  [0805_W]
R65  value 1k  [0805_W]
R66  value 1k  [0805_W]
R67  value 1k  [0805_W]
R68  value 47k  [0805_W]
R69  value 47k  [0805_W]
R70  value 47k  [0805_W]
R71  value 47k  [0805_W]
R72  value 1k  [0805_W]
R74  value 47R  [0805_W]
R75  value 47R  [0805_W]
R76  value 47R  [0805_W]
R77  value 47R  [0805_W]
R78  value 47R  [0805_W]
R79  pn: 47R  [0805_W]
R80  value 47R  [0805_W]
R81  value 47R  [0805_W]
R82  value 47R  [0805_W]
U10  value SN74LS32  [SO14-Wide]  (parts A,B,C,D of 4)
U11  value SN74HCT125  [SO14-Wide]
U12  value 74LVC06AS14  [SOIC-14N]  (parts A,B,C,D,E,F of 6)
U13  value SN74LS279  (parts A,B,C,D of 4)
U14  value SN74HCT125  [SO14-Wide]
U15  value SN74HCT125  [SO14-Wide]

### Ports
+5V (in), en-ph1 (out), en-ph2 (out), en-ph3 (out), en-ph4 (out), GND (in), in_enable (in), in_fault-reset (in), in_phB1 (in), in_phB2 (in), in_phB3 (in), in_phB4 (in), in_phT1 (in), in_phT2 (in), in_phT3 (in), in_phT4 (in), in_relay1 (in), in_relay2 (in), ok-ph1 (in), ok-ph2 (in), ok-ph3 (in), ok-ph4 (in), out_ok (out), out_ok-ph1 (out), out_ok-ph2 (out), out_ok-ph3 (out), out_ok-ph4 (out), phB1 (out), phB2 (out), phB3 (out), phB4 (out), phT1 (out), phT2 (out), phT3 (out), phT4 (out), relay1 (out), relay2 (out)

### Nets
+5V: C35.1 C36.1 C37.1 C38.1 C39.1 C40.1 D445.1(A) R50.2 U10.14(VCC) U11.14(VCC) U12.14(VCC) U13.2(~{S}1) U13.12(~{S}2) U13.16(VCC) U14.14(VCC) U15.14(VCC) ; port +5V
GND: C35.2 C36.2 C37.2 C38.2 C39.2 C40.2 D26.2(K) D27.2(K) D28.2(K) D29.2(K) R5.1 R12.1 R18.1 R19.1 R20.1 R21.1 R22.1 R23.1 R24.1 R25.1 R26.1 R49.2 R52.1 R53.1 R54.1 R55.1 R56.1 R57.1 R58.1 R59.1 R60.1 R61.1 R62.1 R63.1 R68.1 R69.1 R70.1 R71.1 R72.2 U10.7(GND) U11.7(GND) U11.10(~{OE}3) U12.7(GND) U13.8(GND) U14.7(GND) U15.7(GND) ; port GND  [project net 0]
en-ph1: D21.2(K) Q7.2(E) U10.8(3Y) ; port en-ph1, port en-ph2
enable: D9.1(A) U10.9(3A) U10.10(3B) U11.1(~{OE}1) U11.8(Y3) ; port en-ph3, port en-ph4  [project net en-ph3]
fault: JP5.1 R48.1 U10.11(4Y) U12.9(4A) U12.11(5A)
fault-reset': Manual_Reset.1 Q7.3(C) R50.1 U13.1(~{R}) U13.5(~{R}) U13.10(~{R}) U13.14(~{R})
fault_ph1: D22.1(A) R64.2 U10.1(1A) U12.13(6A) U13.9(Q)
fault_ph2: D23.1(A) R65.2 U10.2(1B) U12.1(1A) U13.13(Q)
fault_ph3: D24.1(A) R66.2 U10.4(2A) U12.3(2A) U13.4(Q)
fault_ph4: D25.1(A) R67.2 U10.5(2B) U12.5(3A) U13.7(Q)
ok-ph1: U13.11(~{S}1) ; port ok-ph1
ok-ph2: U13.15(~{S}) ; port ok-ph2
ok-ph3: U13.3(~{S}2) ; port ok-ph3
ok-ph4: U13.6(~{S}) ; port ok-ph4
phB: R20.2 U14.3(Y1) ; port phB1
phB: R21.2 U14.8(Y3) ; port phB2  [a separate net that carries the same name]
phB: R23.2 U15.3(Y1) ; port phB3  [a separate net that carries the same name]
phB: R25.2 U15.8(Y3) ; port phB4  [a separate net that carries the same name]
phT: R22.2 U14.11(Y4) ; port phT2
phT: R19.2 U14.6(Y2) ; port phT1  [a separate net that carries the same name]
phT: R26.2 U15.11(Y4) ; port phT4  [a separate net that carries the same name]
phT: R24.2 U15.6(Y2) ; port phT3  [a separate net that carries the same name]
NetD9_2: D9.2(K) R72.1
NetD21_1: D21.1(A) Manual_Reset.2
NetD22_2: D22.2(K) P3000.1 R68.2 U14.1(~{OE}1) U14.4(~{OE}2)
NetD23_2: D23.2(K) P3000.3 R69.2 U14.10(~{OE}3) U14.13(~{OE}4)
NetD24_2: D24.2(K) P3000.8 R70.2 U15.1(~{OE}1) U15.4(~{OE}2)
NetD25_2: D25.2(K) P3000.10 R71.2 U15.10(~{OE}3) U15.13(~{OE}4)
NetD26_1: D26.1(A) R64.1
NetD27_1: D27.1(A) R65.1
NetD28_1: D28.1(A) R66.1
NetD29_1: D29.1(A) R67.1
NetD445_2: D445.2(K) R48.2
NetFaults?_2: U12.12(6~{Y}) ; port out_ok-ph1
NetFaults?_3: U12.2(1~{Y}) ; port out_ok-ph2
NetFaults?_4: U12.4(2~{Y}) ; port out_ok-ph3
NetFaults?_5: U12.6(3~{Y}) ; port out_ok-ph4
NetINV_CONTROL?_3: U12.8(4~{Y}) U12.10(5~{Y}) ; port out_ok
NetINV_CONTROL?_4: R39.2 R54.2 ; port in_relay1
NetINV_CONTROL?_5: R55.2 R74.2 ; port in_relay2
NetINV_CONTROL?_6: R38.2 R53.2 ; port in_fault-reset
NetINV_CONTROL?_7: R36.2 R52.2 ; port in_enable
NetJP5_2: JP5.2 R49.1 U11.4(~{OE}2) U11.13(~{OE}4)
NetP3000_2: P3000.2 P3000.4 P3000.6
NetP3000_5: P3000.5 P3000.7 P3000.9
NetPWM_AB?_1: R56.2 R75.2 ; port in_phT1
NetPWM_AB?_3: R57.2 R76.2 ; port in_phB1
NetPWM_AB?_5: R59.2 R78.2 ; port in_phT2
NetPWM_AB?_7: R58.2 R77.2 ; port in_phB2
NetPWM_CN?_1: R60.2 R79.2 ; port in_phT3
NetPWM_CN?_3: R61.2 R80.2 ; port in_phB3
NetPWM_CN?_5: R63.2 R82.2 ; port in_phT4
NetPWM_CN?_7: R62.2 R81.2 ; port in_phB4
NetQ7_1: Q7.1(B) R51.2
NetR2_1: R12.2 U11.6(Y2) ; port relay1
NetR4_1: R18.2 U11.11(Y4) ; port relay2
NetR5_2: R5.2 R51.1 U11.3(Y1)
NetR36_1: R36.1 U11.9(A3)
NetR38_1: R38.1 U11.2(A1)
NetR39_1: R39.1 U11.5(A2)
NetR74_1: R74.1 U11.12(A4)
NetR75_1: R75.1 U14.5(A2)
NetR76_1: R76.1 U14.2(A1)
NetR77_1: R77.1 U14.9(A3)
NetR78_1: R78.1 U14.12(A4)
NetR79_1: R79.1 U15.5(A2)
NetR80_1: R80.1 U15.2(A1)
NetR81_1: R81.1 U15.9(A3)
NetR82_1: R82.1 U15.12(A4)
NetU10_3: U10.3(1Y) U10.13(4B)
NetU10_6: U10.6(2Y) U10.12(4A)

### Notes on the sheet
- Relay fault behaviour:
- Connnecting the jumper make the
- relays open in a fault event.
- Reset behaviour:
- First: disable the board
- Second: pulse the reset
- System ok
- Enable ON
- fault-reset' is active LOW
- Fault signal:
- 1 = Fault
- 0 = OK
- Protection Interlock
- Connect jumpers to interlock
- phase protection
- Title
- Author
- Revisor
- Hildo G Jr
- Revision:
- Sheet
- of
- File:
- Size:
- A4
- HGJr

### Library data of the parts
C35 C36 = Capacitor_nao_polarizado: Capacitor nao polarizado; Value: Value
C37-C40 = Capacitor_nao_polarizado: Capacitor nao polarizado; pn: C0805C104K8RACTU
D9 = LED0: Typical INFRARED GaAs LED; pn: SML-LXR85YC-TR
D21 D23-D25 = D Schottky: Schottky Diode; np: BAT46ZFILM
D22 = D Schottky: Schottky Diode; pn: BAT46ZFILM
D26-D29 = LED0: Typical INFRARED GaAs LED; pn: SML-LXR85IC-TR
D445 = LED0: Typical INFRARED GaAs LED; pn: SML-LXR85GC-TR
JP5 = Header 2: Header, 2-Pin
Manual_Reset = SW-PB: Switch; pn: FSM4JH
P3000 = Header 5X2: Header, 5-Pin, Dual row
Q7 = BC847: as Q2 on sheet DriverAndProtection
R5 R12 R18-R26 R52-R55 R68-R71 = Res_0805: Resistor; pn: RMCF0805JT47K0
R36 R38 R39 R74-R78 R80-R82 = Res_0805: Resistor; pn: RMCF0805JT47R0
R48 R50 R64-R67 R72 = Res_0805: Resistor; pn: RMCF0805JT1K00
R49 R56-R63 = Res_0805: as R91 on sheet MainPower; Published: 08/06/2000; Publisher: Altium Hobart Technology Centre; SubClass: Resistor; Value: Value
R51 = Res_0805: Resistor; pn: RMCF0805JT4K70
R79 = Res_0805: Resistor; Published: RMCF0805JT47R0
U10 = HD74HC32FP: Quad 2-Input OR Gates; pn: SN74LS32NSR
U11 = M74HC125M1R: Quad Bus Buffer (3-State); pn: SN74HCT125DR
U12 = HD74LV06AFP: Hex Inverter Buffers / Drivers with Open Drain Outputs; Publisher: 74LVC06AS14-13
U13 = SN74LS279AD: Quadruple S-R Latches; pn: SN74LS279ANSR
U14 U15 = M74HC125M1R: Quad Bus Buffer (3-State); Publisher: SN74HCT125DR

## Sheet Auxiliary.SchDoc: Relays & auxiliary circuits
size A4; CheckedBy: Fellipe; Author: Hildo Guillardi Júnior; Organization: UNICAMP / LCEE; Address1: University of Campinas - Brazil; Address2: Power Conditioning Laboratory; Address3: Licensed by GNU GPL 3.0; ProjectName: Easy Inverter
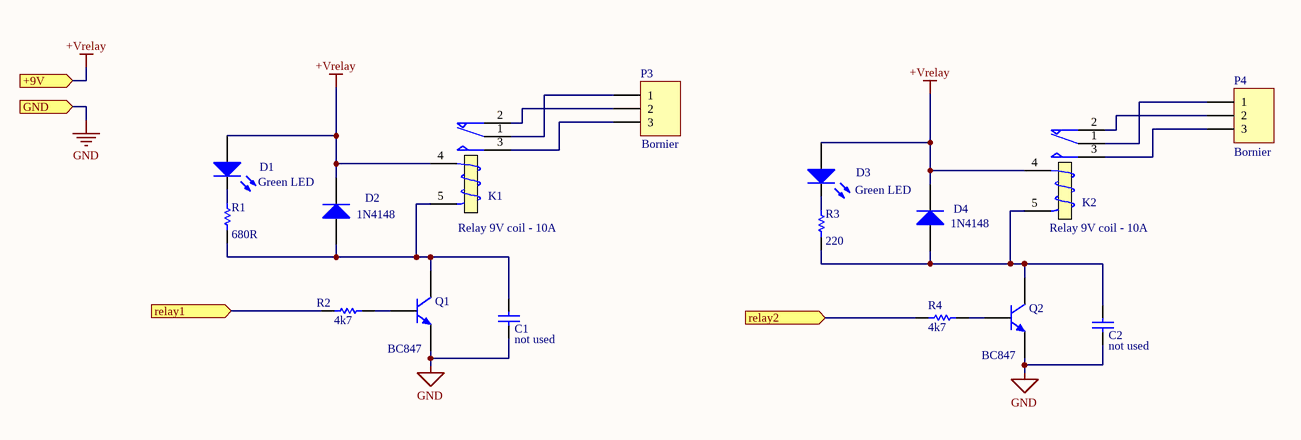
[diagram p5: Auxiliary.SchDoc]

### Parts
C1  value not used  [0805_W]
C2  value not used  [0805_W]
D1  value Green LED  [LED_0805]
D2  value 1N4148  [SOD-123]
D3  value Green LED  [LED_0805]
D4  value 1N4148  [SOD-123]
K1  value Relay 9V coil - 10A  [Relay - SPDT]
K2  value Relay 9V coil - 10A  [Relay - SPDT]
P3  value Bornier  [KK-3_G]
P4  value Bornier  [KK-3_G]
Q1  value BC847  [SOT-23-TT3_L]
Q2  value BC847  [SOT-23-TT3_L]
R1  value 680R  [0805_W]
R2  value 4k7  [0805_W]
R3  value 220  [0805_W]
R4  value 4k7  [0805_W]

### Ports
+9V (in), GND (in), relay1 (in), relay2 (in)

### Nets
+Vrelay: D1.1(A) D2.2(K) D3.1(A) D4.2(K) K1.4(T1) K2.4(T1) ; port +9V  [project net +9V]
GND: C1.1 C2.1 Q1.2(E) Q2.2(E) ; port GND  [project net 0]
NetC1_2: C1.2 D2.1(A) K1.5(T2) Q1.3(C) R1.2
NetC2_2: C2.2 D4.1(A) K2.5(T2) Q2.3(C) R3.2
NetD1_2: D1.2(K) R1.1
NetD3_2: D3.2(K) R3.1
NetK1_1: K1.1(COM) P3.1
NetK1_2: K1.2(NC) P3.2
NetK1_3: K1.3(NO) P3.3
NetK2_1: K2.1(COM) P4.1
NetK2_2: K2.2(NC) P4.2
NetK2_3: K2.3(NO) P4.3
NetQ1_1: Q1.1(B) R2.2
NetQ2_1: Q2.1(B) R4.2
NetR2_1: R2.1 ; port relay1
NetR4_1: R4.1 ; port relay2

### Notes on the sheet
- Title
- Author
- Revisor
- Hildo G Jr
- Revision:
- Sheet
- of
- File:
- Size:
- A4
- HGJr

### Library data of the parts
C1 C2 = Cap: Capacitor
D1 D3 = LED0: as D445 on sheet LogicCircuits
D2 D4 = Diode 1N4148: High Conductance Fast Diode; pn: 1N4148W-TP
K1 K2 = Relay: SPDT Relay; pn: G5LE-14-DC9
P3 P4 = Header 3: Header, 3-Pin; pn: 1935174
Q1 Q2 = BC847: as Q2 on sheet DriverAndProtection
R1 R3 = Res_0805: Resistor; pn: RMCF0805JT680R
R2 R4 = Res1: Resistor; pn: RMCF0805JT4K70

## Sheet DeadTimeDriver_Leg.SchDoc: Dead time & interlock
size A4; CheckedBy: Hildo / Joel; Author: Fellipe; Organization: UNICAMP / LCEE; Address1: University of Campinas - Brazil; Address2: Power Conditioning Laboratory; Address3: Licensed by GNU GPL 3.0; ProjectName: Easy Inverter
Used 4 times, as channels DT1, DT2, DT3, DT4. Parts and nets are listed once, with the designators drawn on the sheet.
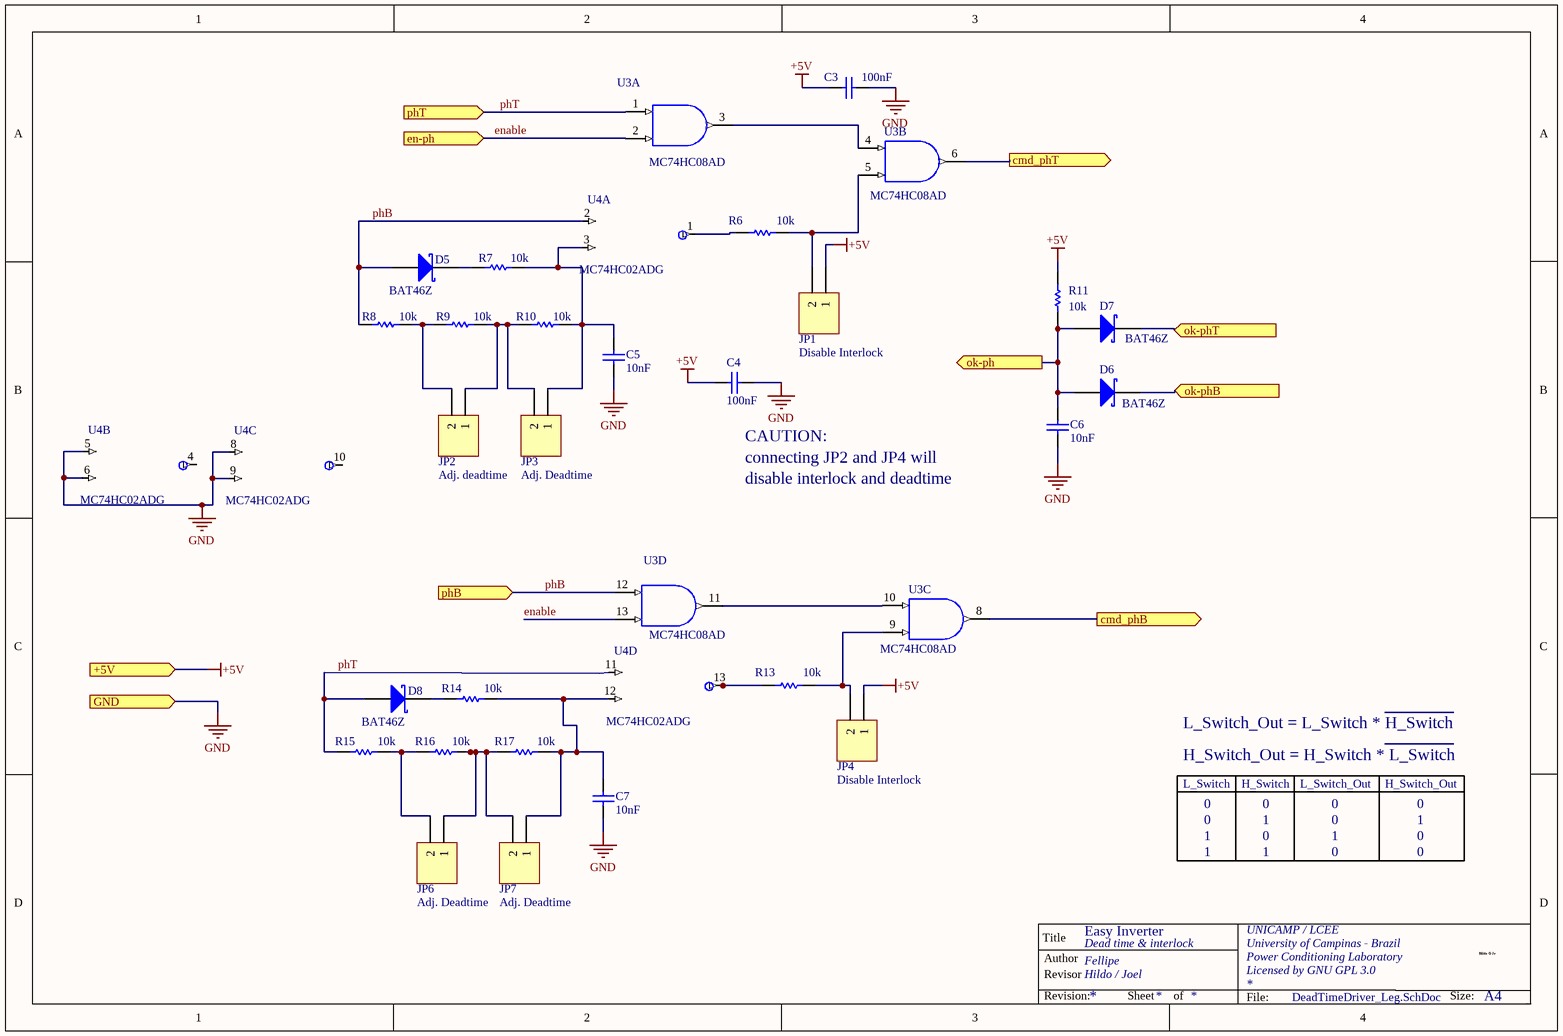
[diagram p6: DeadTimeDriver_Leg.SchDoc]

### Parts
C3  value 100nF  [0805_W]
C4  value 100nF  [0805_W]
C5  value 10nF  [0805_W]
C6  value 10nF  [0805_W]
C7  value 10nF  [0805_W]
D5  value BAT46Z  [SOD-123]
D6  value BAT46Z  [SOD-123]
D7  value BAT46Z  [SOD-123]
D8  value BAT46Z  [SOD-123]
JP1  Disable Interlock  [Jumper]
JP2  Adj. deadtime  [Jumper]
JP3  Adj. Deadtime  [Jumper]
JP4  Disable Interlock  [Jumper]
JP6  Adj. Deadtime  [Jumper]
JP7  Adj. Deadtime  [Jumper]
R6  value 10k  [0805_W]
R7  value 10k  [0805_W]
R8  value 10k  [0805_W]
R9  value 10k  [0805_W]
R10  value 10k  [0805_W]
R11  value 10k  [0805_W]
R13  value 10k  [0805_W]
R14  value 10k  [0805_W]
R15  value 10k  [0805_W]
R16  value 10k  [0805_W]
R17  value 10k  [0805_W]
U3  value MC74HC08AD  [SOIC-14N]  (parts A,B,C,D of 4)
U4  value MC74HC02ADG  [SOIC-14N]  (parts A,B,C,D of 4)

### Ports
+5V (in), cmd_phB (out), cmd_phT (out), en-ph (in), GND (in), ok-ph (out), ok-phB (in), ok-phT (in), phB (in), phT (in)

### Nets
+5V: C3.1 C4.1 JP1.1 JP4.1 R11.2 U3.14(VDD) U4.14(VDD) ; port +5V
GND: C3.2 C4.2 C5.2 C6.2 C7.2 U3.7(GND) U4.5 U4.6 U4.7(GND) U4.8 U4.9 ; port GND
cmd_phB: U3.8(Y) ; port cmd_phB
cmd_phT: U3.6(Y) ; port cmd_phT
enable: U3.2(B) U3.13(B) ; port en-ph
ok-ph: C6.1 D6.1(A) D7.1(A) R11.1 ; port ok-ph
ok-phB: D6.2(K) ; port ok-phB
ok-phT: D7.2(K) ; port ok-phT
phB: D5.1(A) R8.1 U3.12(A) U4.2 ; port phB
phT: D8.1(A) R15.1 U3.1(A) U4.11 ; port phT
NetC5_1: C5.1 JP3.1 R7.2 R10.2 U4.3
NetC7_1: C7.1 JP7.1 R14.2 R17.2 U4.12
NetD5_2: D5.2(K) R7.1
NetD8_2: D8.2(K) R14.1
NetJP1_2: JP1.2 R6.2 U3.5(B)
NetJP2_1: JP2.1 JP3.2 R9.2 R10.1
NetJP2_2: JP2.2 R8.2 R9.1
NetJP4_2: JP4.2 R13.2 U3.9(A)
NetJP6_1: JP6.1 JP7.2 R16.2 R17.1
NetJP6_2: JP6.2 R15.2 R16.1
NetR6_1: R6.1 U4.1
NetR13_1: R13.1 U4.13
NetU3_3: U3.3(Y) U3.4(A)
NetU3_10: U3.10(B) U3.11(Y)

Not connected (* = marked no-connect by the designer): U4 4 10

### Channels
DT1: designators end in _DT1; ports +5V=+5V cmd_phB=cmd_phB1 cmd_phT=cmd_phT1 en-ph=en-ph1 GND=0 ok-ph=ok-ph1 ok-phB=ok-phB1 ok-phT=ok-phT1 phB=phB phT=phT
DT2: designators end in _DT2; ports +5V=+5V cmd_phB=cmd_phB2 cmd_phT=cmd_phT2 en-ph=en-ph1 GND=0 ok-ph=ok-ph2 ok-phB=ok-phB2 ok-phT=ok-phT2 phB=phB phT=phT
DT3: designators end in _DT3; ports +5V=+5V cmd_phB=cmd_phB3 cmd_phT=cmd_phT3 en-ph=en-ph3 GND=0 ok-ph=ok-ph3 ok-phB=ok-phB3 ok-phT=ok-phT3 phB=phB phT=phT
DT4: designators end in _DT4; ports +5V=+5V cmd_phB=cmd_phB4 cmd_phT=cmd_phT4 en-ph=en-ph3 GND=0 ok-ph=ok-ph4 ok-phB=ok-phB4 ok-phT=ok-phT4 phB=phB phT=phT

### Notes on the sheet
- (near C4) CAUTION:
- connecting JP2 and JP4 will
- disable interlock and deadtime
- L_Switch
- L_Switch_Out = L_Switch * H_Switch
- H_Switch_Out = H_Switch * L_Switch
- H_Switch
- L_Switch_Out
- H_Switch_Out
- 0
- 1
- Title
- Author
- Revisor
- Hildo G Jr
- Revision:
- Sheet
- of
- File:
- Size:
- A4
- HGJr

### Library data of the parts
C3 C4 = Capacitor_nao_polarizado: as C20 on sheet GateDriverPowerSupply
C5-C7 = Cap_0805: Capacitor; Published: 8-Jun-2000; LatestRevisionDate: 17-Jul-2002; LatestRevisionNote: Re-released for DXP Platform.; PackageReference: RAD-0.3; Publisher: Altium Limited; Value: Value
D5-D8 = D Schottky: Schottky Diode; pn: BAT46ZFILM
JP1-JP4 JP6 JP7 = Header 2: Header, 2-Pin; Value: solder jumper
R6-R11 R13-R17 = Res_0805: as R91 on sheet MainPower; Published: 08/06/2000; Publisher: Altium Hobart Technology Centre; SubClass: Resistor; Value: Value
U3 = MC74HC08AD: Quad 2-Input AND Gate; pn: MC74HC08ADG
U4 = Double 2-input NOR: SN74AUP2G02DCUR; pn: MC74HC02ADG

## Sheet MainPowerSupply.SchDoc: Main power supply
size A4; CheckedBy: Hildo Guillardi Júnior; Author: Joel Guerreiro; Organization: UNICAMP / LCEE; Address1: University of Campinas - Brazil; Address2: Power Conditioning Laboratory; Address3: Licensed by GNU GPL 3.0; Revision: Hildo Guillardi Júnior; ProjectName: Easy Inverter
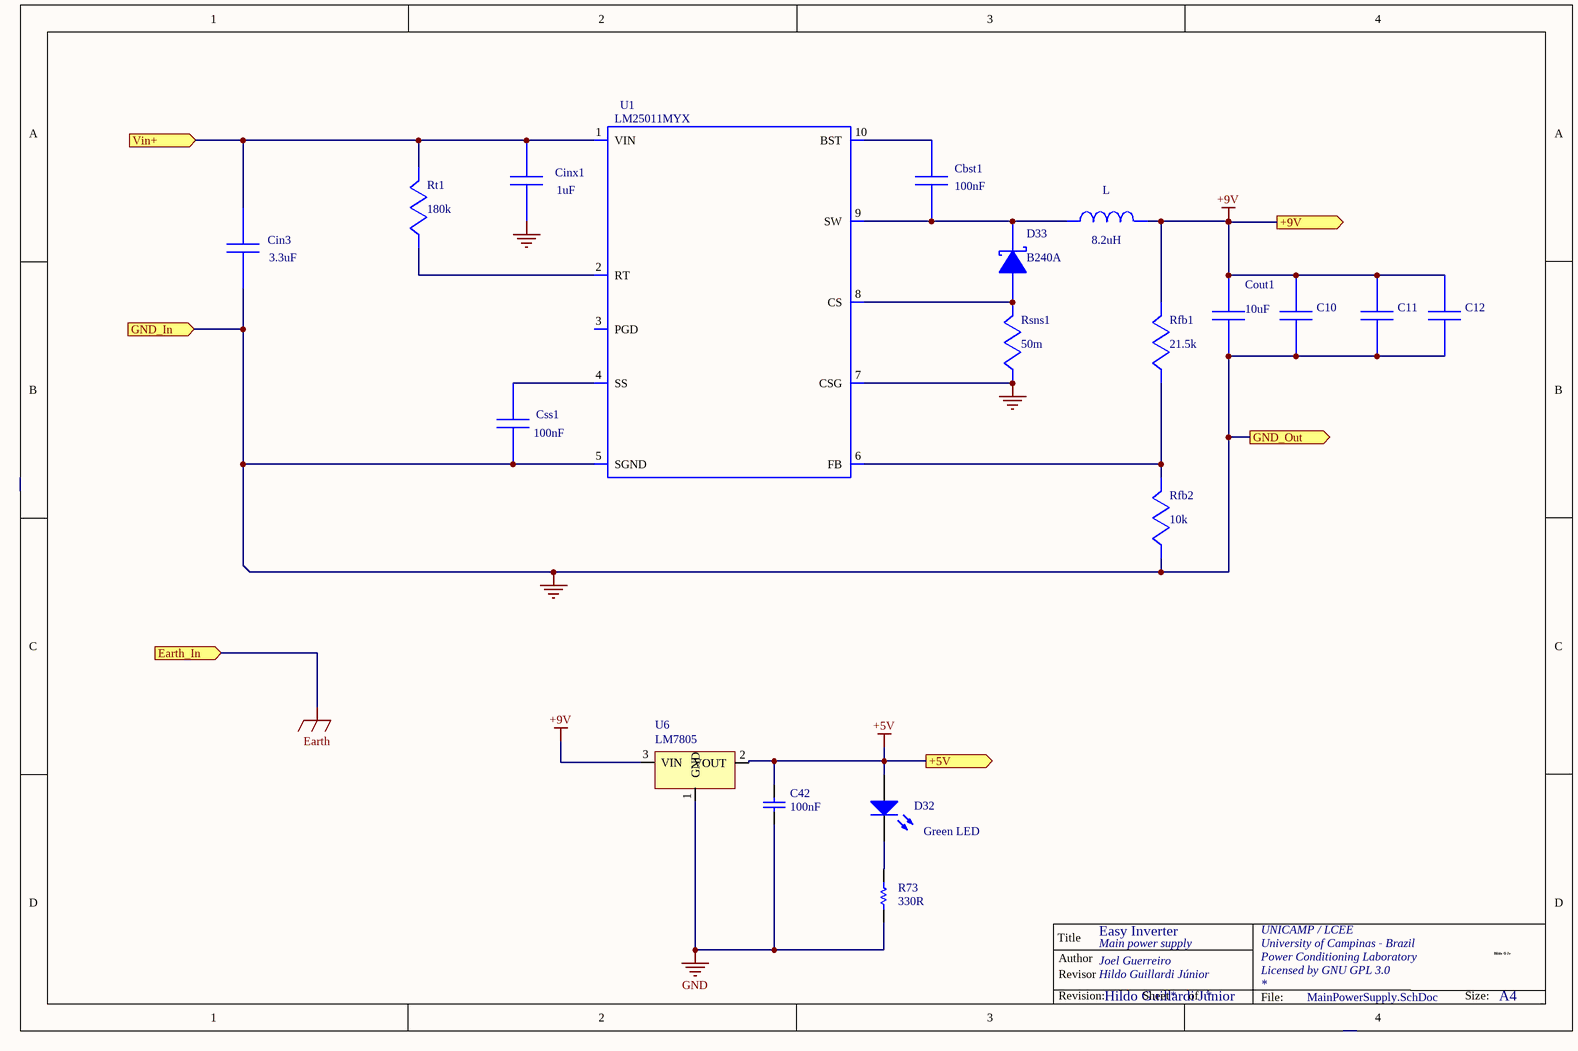
[diagram p7: MainPowerSupply.SchDoc]

### Parts
C10  (no value)  [0805_W]
C11  (no value)  [0805_W]
C12  (no value)  [0805_W]
C42  value 100nF  [0805_W]
Cbst1  value 100nF  [0805_W]
Cin3  value 3.3uF  [1210_W]
Cinx1  value 1uF  [0805_W]
Cout1  value 10uF  [0805_W]
Css1  value 100nF  [0805_W]
D32  value Green LED  [LED_0805]
D33  value B240A  [SOD-123]
L  value 8.2uH  [SRN8040T - Inductor]
R73  value 330R  [0805_W]
Rfb1  value 21.5k  [0805_W]
Rfb2  value 10k  [0805_W]
Rsns1  value 50m  [0805_W]
Rt1  value 180k  [0805_W]
U1  value LM25011MYX  [10MSOP]
U6  value LM7805  [LM7805]

### Ports
+5V (out), +9V (out), Earth_In (in), GND_In (in), GND_Out (out), Vin+ (in)

### Nets
0: C10.2 C11.2 C12.2 C42.2 Cin3.2 Cinx1.2 Cout1.2 Css1.2 R73.1 Rfb2.2 Rsns1.2 U1.5(SGND) U1.7(CSG) U6.1(GND) ; port GND_In, port GND_Out  [also labelled GND]
+5V: C42.1 D32.1(A) U6.2(VOUT) ; port +5V
+9V: C10.1 C11.1 C12.1 Cout1.1 L.2 Rfb1.1 U6.3(VIN) ; port +9V
NetCbst1_1: Cbst1.1 U1.10(BST)
NetCbst1_2: Cbst1.2 D33.2(K) L.1 U1.9(SW)
NetCin3_1: Cin3.1 Cinx1.1 Rt1.1 U1.1(VIN) ; port Vin+
NetCss1_1: Css1.1 U1.4(SS)
NetD32_2: D32.2(K) R73.2
NetD33_1: D33.1(A) Rsns1.1 U1.8(CS)
NetRfb1_2: Rfb1.2 Rfb2.1 U1.6(FB)
NetRt1_2: Rt1.2 U1.2(RT)

Not connected (* = marked no-connect by the designer): U1 3(PGD)

### Notes on the sheet
- Title
- Author
- Revisor
- Hildo G Jr
- Revision:
- Sheet
- of
- File:
- Size:
- A4
- HGJr

### Library data of the parts
C10-C12 = GRM21BR61C106KE15L: GRM21BR61C106KE1; Manufacturer Name: MuRata; PackageReference: GRM21BR61C106KE15L; Manufacturer Part Number: GRM21BR61C106KE15L; Value: Value
C42 = Capacitor_nao_polarizado: as C20 on sheet GateDriverPowerSupply
Cbst1 Css1 = CC0805KRX7R8BB104: CC0805KRX7R8BB10; pn: 08053C104KAT2A
Cin3 = C3225X7S2A335K200AB: C3225X7S2A335K20; Manufacturer Name: TDK; PackageReference: C3225X7S2A335K200AB; Manufacturer Part Number: C3225X7S2A335K200AB; Value: Value
Cinx1 = C1608X5R1H105K080AB: C1608X5R1H105K08; Manufacturer Name: TDK; PackageReference: C1608X5R1H105K080AB; Manufacturer Part Number: C1608X5R1H105K080AB; Value: Value
Cout1 = C0805C106K8PACTU: pn: C0805C106K8PACTU
D32 = LED0: as D445 on sheet LogicCircuits
D33 = B360A-13-F: pn: B360A-13-F
L = SRN8040-8R2Y: pn: SRN8040-8R2Y
R73 = Res_0805: Resistor; pn: RMCF0805JT330R
Rfb1 = CRCW040221K5FKED: Manufacturer Name: Vishay-Dale; PackageReference: CRCW040221K5FKED; Manufacturer Part Number: CRCW040221K5FKED; Value: Value
Rfb2 = CRCW040210K0FKED: Manufacturer Name: Vishay-Dale; PackageReference: CRCW040210K0FKED; Manufacturer Part Number: CRCW040210K0FKED; Value: Value
Rsns1 = CRM0805-FW-R050ELF: CRM0805-FW-R050E; Manufacturer Name: Bourns; PackageReference: CRM0805-FW-R050ELF; Manufacturer Part Number: CRM0805-FW-R050ELF; Value: Value
Rt1 = CRCW0402174KFKED: Manufacturer Name: Vishay-Dale; PackageReference: CRCW0402174KFKED; Manufacturer Part Number: CRCW0402174KFKED; Value: Value
U1 = LM25011MYX/NOPB: pn: LM25011MYX/NOPB
U6 = LM7805: pn: MC7805BDTG

## Sheet GateCircuit.SchDoc: Gate drive circuit
size A4; Author: Hildo Guillardi Júnior; Organization: UNICAMP / LCEE; Address1: University of Campinas - Brazil; Address2: Power Conditioning Laboratory; Address3: Licensed by GNU GPL 3.0; ProjectName: Easy Inverter
Used 8 times, as channels GateCircuit_B1, GateCircuit_B2, GateCircuit_B3, GateCircuit_B4, GateCircuit_B1, GateCircuit_B2, GateCircuit_B3, GateCircuit_B4. Parts and nets are listed once, with the designators drawn on the sheet.
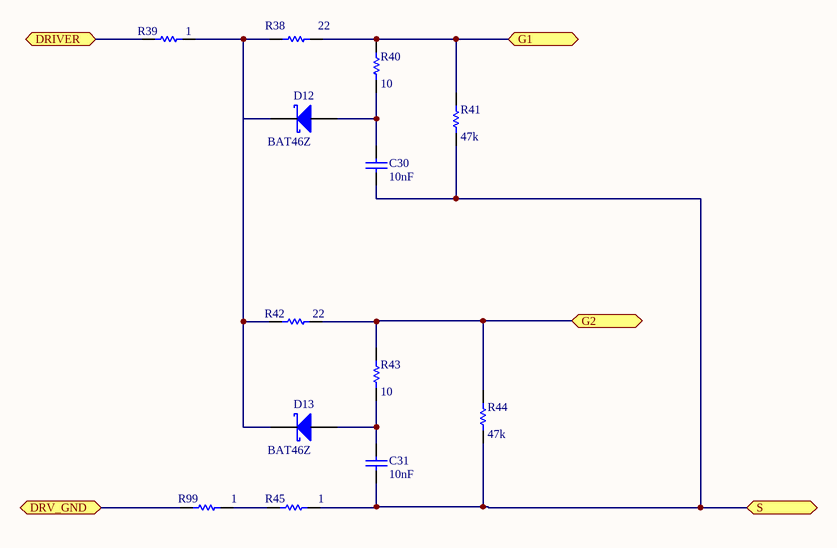
[diagram p8: GateCircuit.SchDoc]

### Parts
C30  value 10nF  [0805_W]
C31  value 10nF  [0805_W]
D12  value BAT46Z  [SOD-123]
D13  value BAT46Z  [SOD-123]
R38  value 22  [1210_W]
R39  value 1  [0805_W]
R40  value 10  [0805_W]
R41  value 47k  [0805_W]
R42  value 22  [1210_W]
R43  value 10  [0805_W]
R44  value 47k  [0805_W]
R45  value 1  [0805_W]
R99  value 1  [0805_W]

### Ports
DRIVER, DRV_GND, G1, G2, S

### Nets
DRIVER: R39.2 ; port DRIVER
DRV_GND: R99.2 ; port DRV_GND
G1: R38.1 R40.1 R41.1 ; port G1
G2: R42.1 R43.1 R44.1 ; port G2
S: C30.1 C31.1 R41.2 R44.2 R45.1 ; port S
NetC30_2: C30.2 D12.1(A) R40.2
NetC31_2: C31.2 D13.1(A) R43.2
NetD12_2: D12.2(K) D13.2(K) R38.2 R39.1 R42.2
NetR45_2: R45.2 R99.1

### Channels
GateCircuit_B1: designators end in _GateCircuit_B1#1; ports DRIVER=T_CMD1 DRV_GND=T_GND1 G1=T_G11 G2=T_G21 S=B_D1
GateCircuit_B2: designators end in _GateCircuit_B2#1; ports DRIVER=T_CMD2 DRV_GND=T_GND2 G1=T_G12 G2=T_G22 S=B_D2
GateCircuit_B3: designators end in _GateCircuit_B3#1; ports DRIVER=T_CMD3 DRV_GND=T_GND3 G1=T_G13 G2=T_G23 S=B_D3
GateCircuit_B4: designators end in _GateCircuit_B4#1; ports DRIVER=T_CMD4 DRV_GND=T_GND4 G1=T_G14 G2=T_G24 S=T_S4
GateCircuit_B1: designators end in _GateCircuit_B1#2; ports DRIVER=B_CMD1 DRV_GND=B_GND1 G1=B_G11 G2=B_G21 S=B_D2
GateCircuit_B2: designators end in _GateCircuit_B2#2; ports DRIVER=B_CMD2 DRV_GND=B_GND2 G1=B_G12 G2=B_G22 S=B_S2
GateCircuit_B3: designators end in _GateCircuit_B3#2; ports DRIVER=B_CMD3 DRV_GND=B_GND3 G1=B_G13 G2=B_G23 S=B_S3
GateCircuit_B4: designators end in _GateCircuit_B4#2; ports DRIVER=B_CMD4 DRV_GND=B_GND4 G1=B_G14 G2=B_G24 S=B_S4

### Notes on the sheet
- Title
- Author
- Revisor
- Hildo G Jr
- Revision:
- Sheet
- of
- File:
- Size:
- A4
- HGJr

### Library data of the parts
C30 C31 = Cap_0805: Capacitor; Published: 8-Jun-2000; LatestRevisionDate: 17-Jul-2002; LatestRevisionNote: Re-released for DXP Platform.; PackageReference: RAD-0.3; Publisher: Altium Limited
D12 D13 = Schottky: Diodo Schottky; pn: BAT46ZFILM
R38-R45 R99 = Res_0805: as R91 on sheet MainPower; Published: 08/06/2000; Publisher: Altium Hobart Technology Centre; SubClass: Resistor